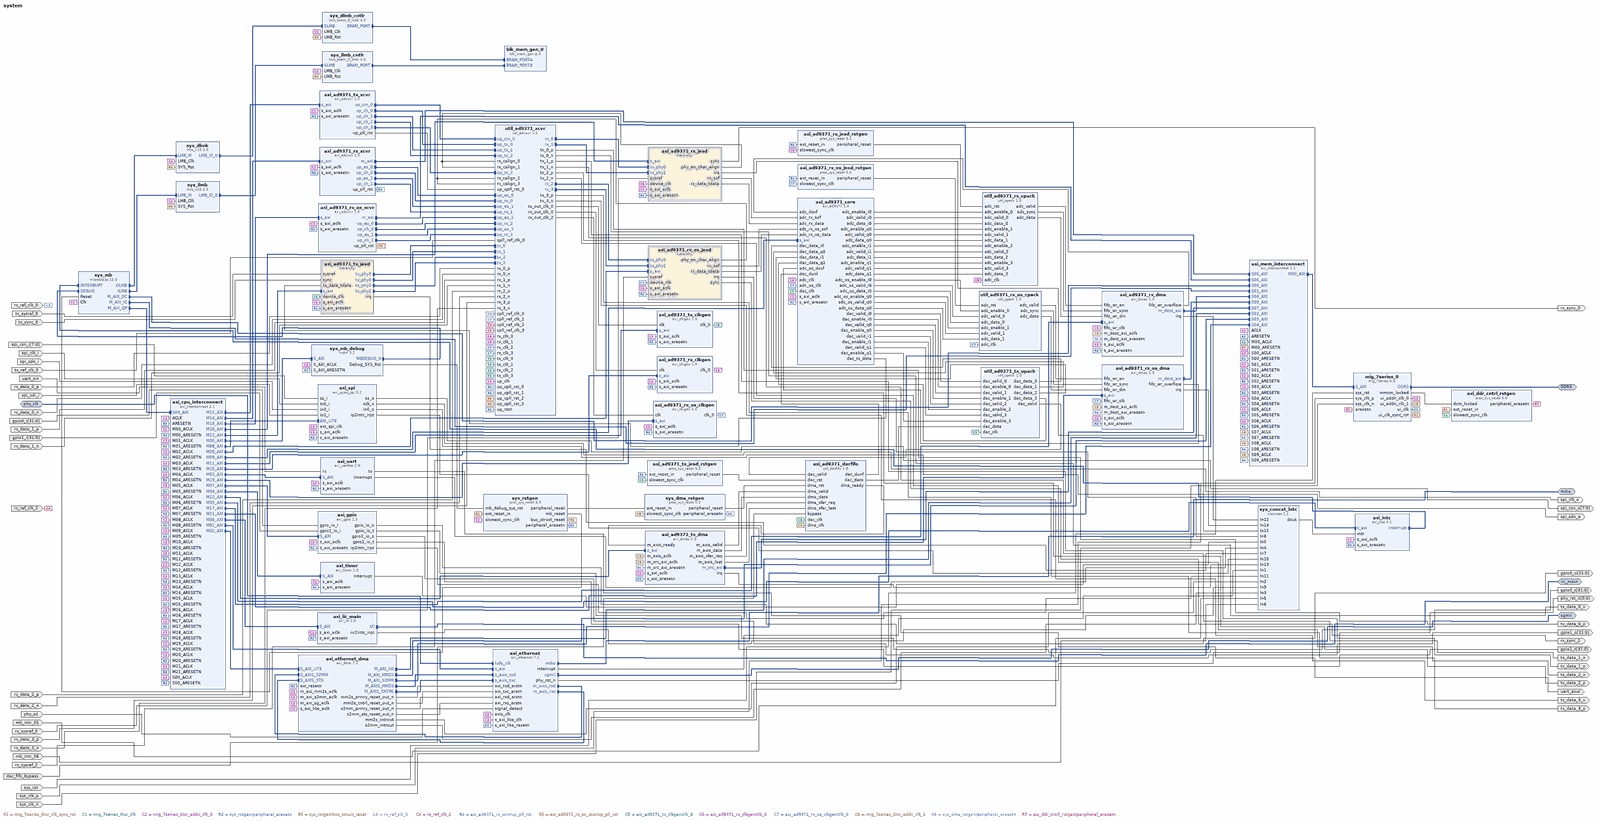
[diagram p0: block diagram of the top level, whole]
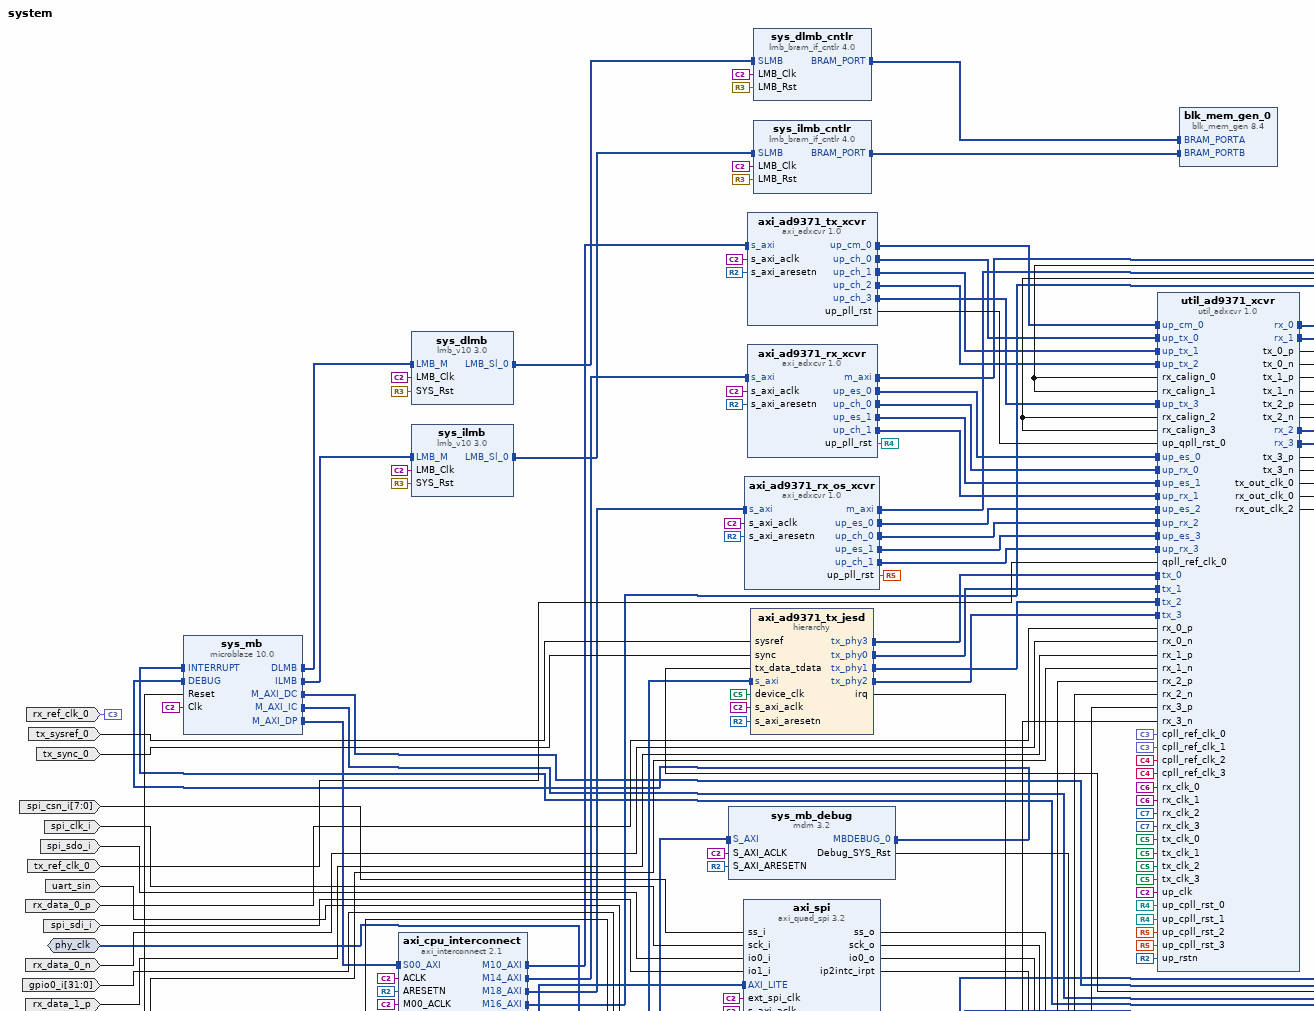
[diagram p1: block diagram of the top level, upper left part]
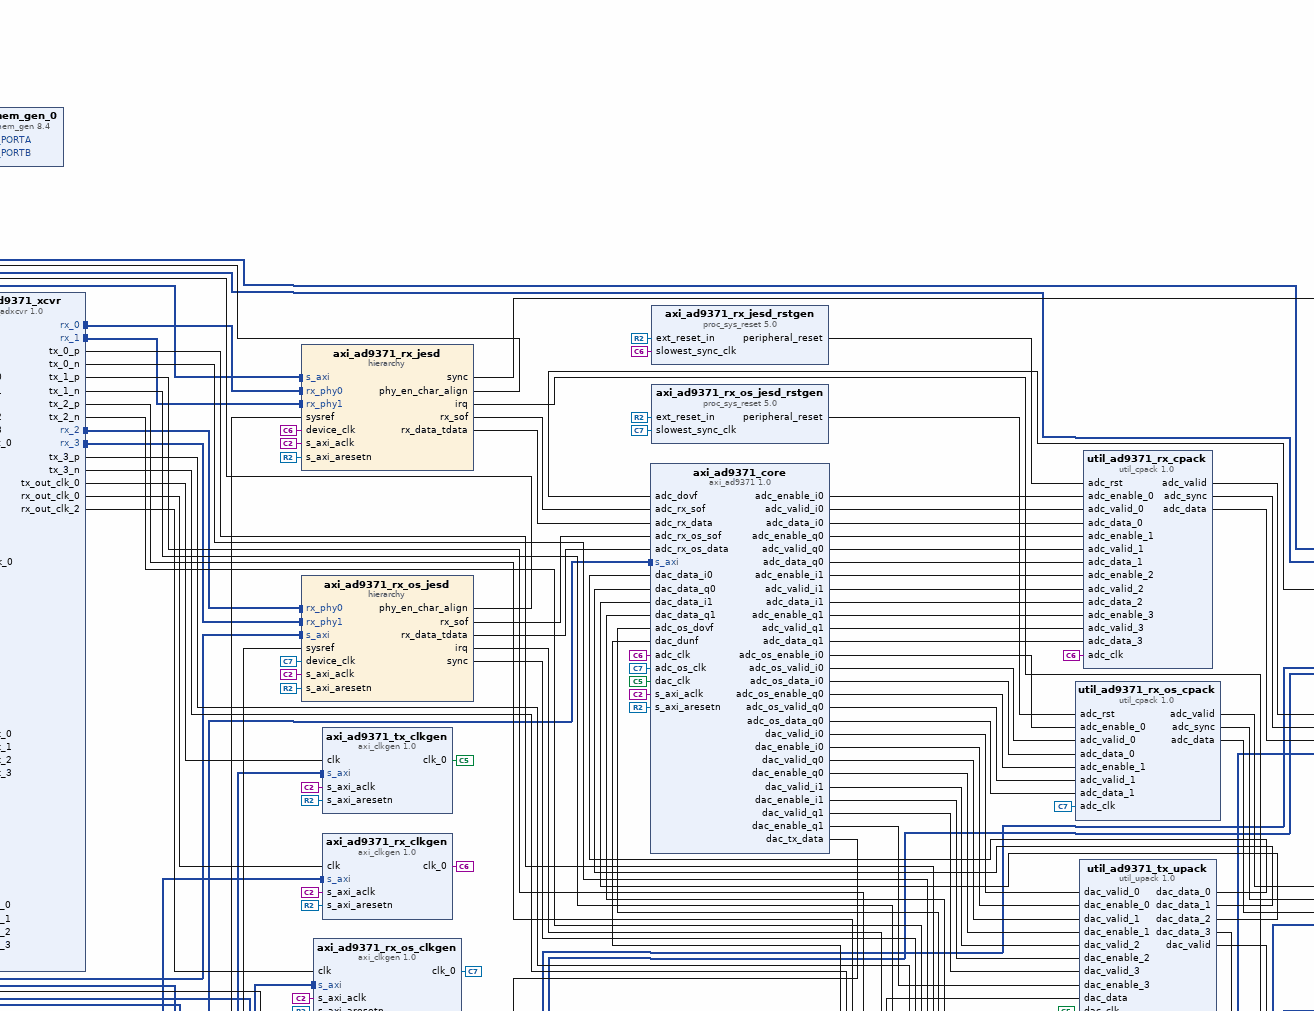
[diagram p2: block diagram of the top level, upper centre part]
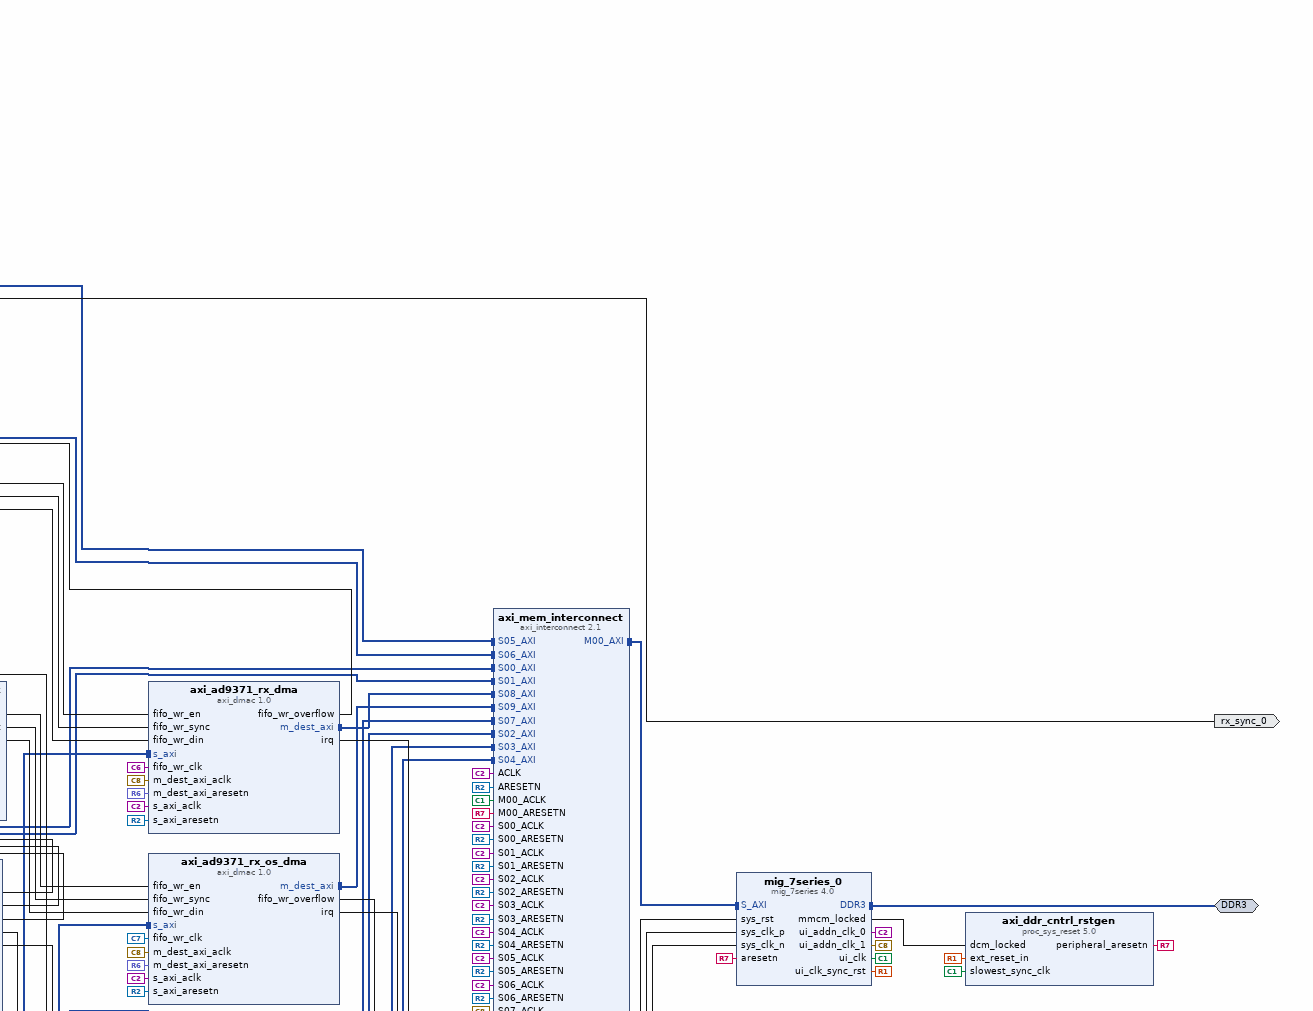
[diagram p3: block diagram of the top level, upper right part]
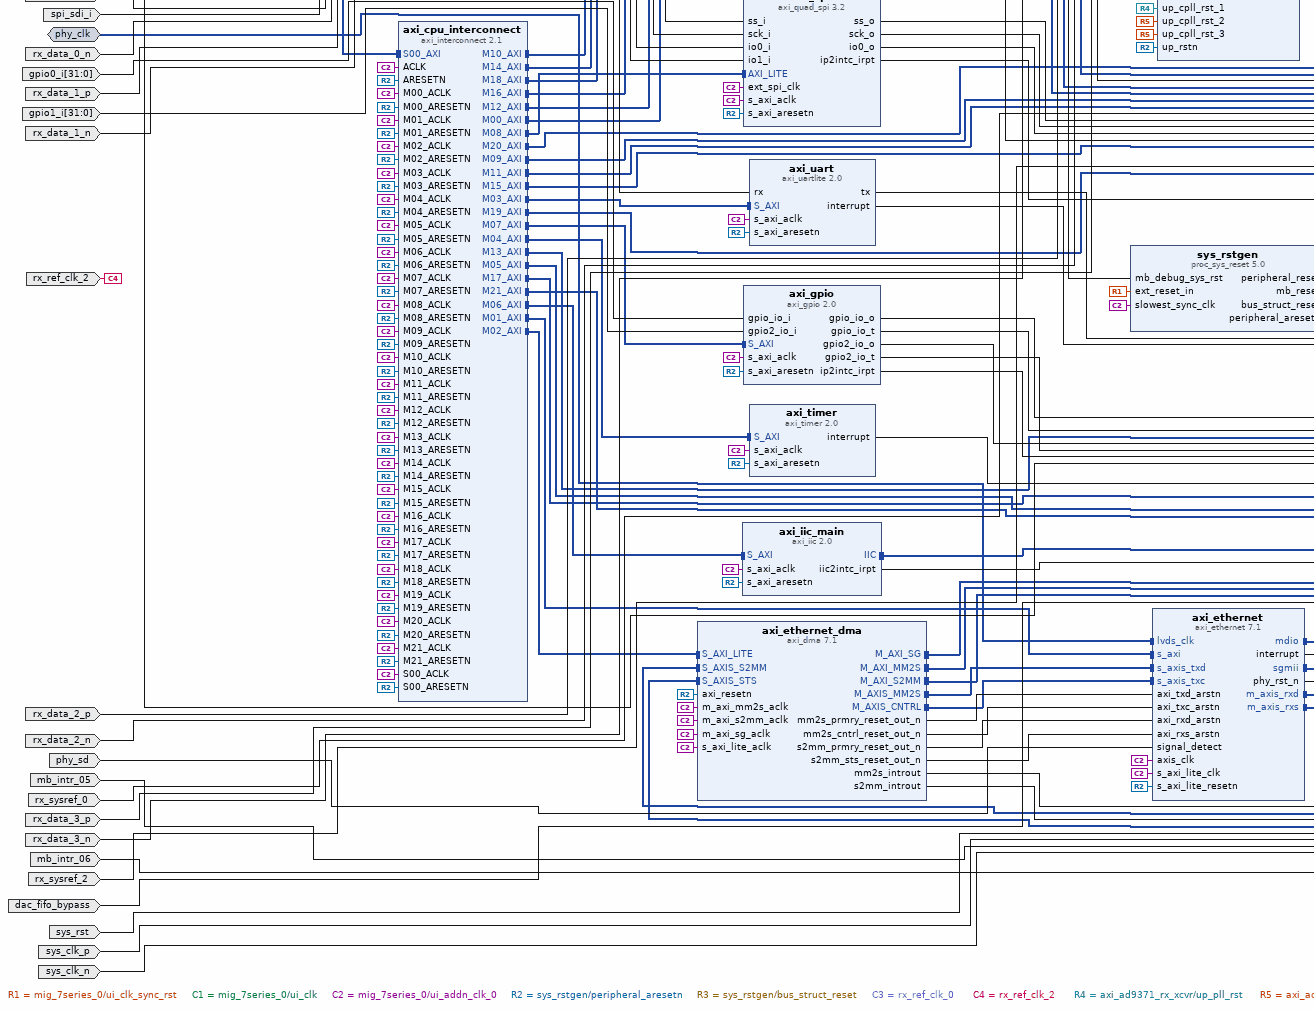
[diagram p4: block diagram of the top level, lower left part]
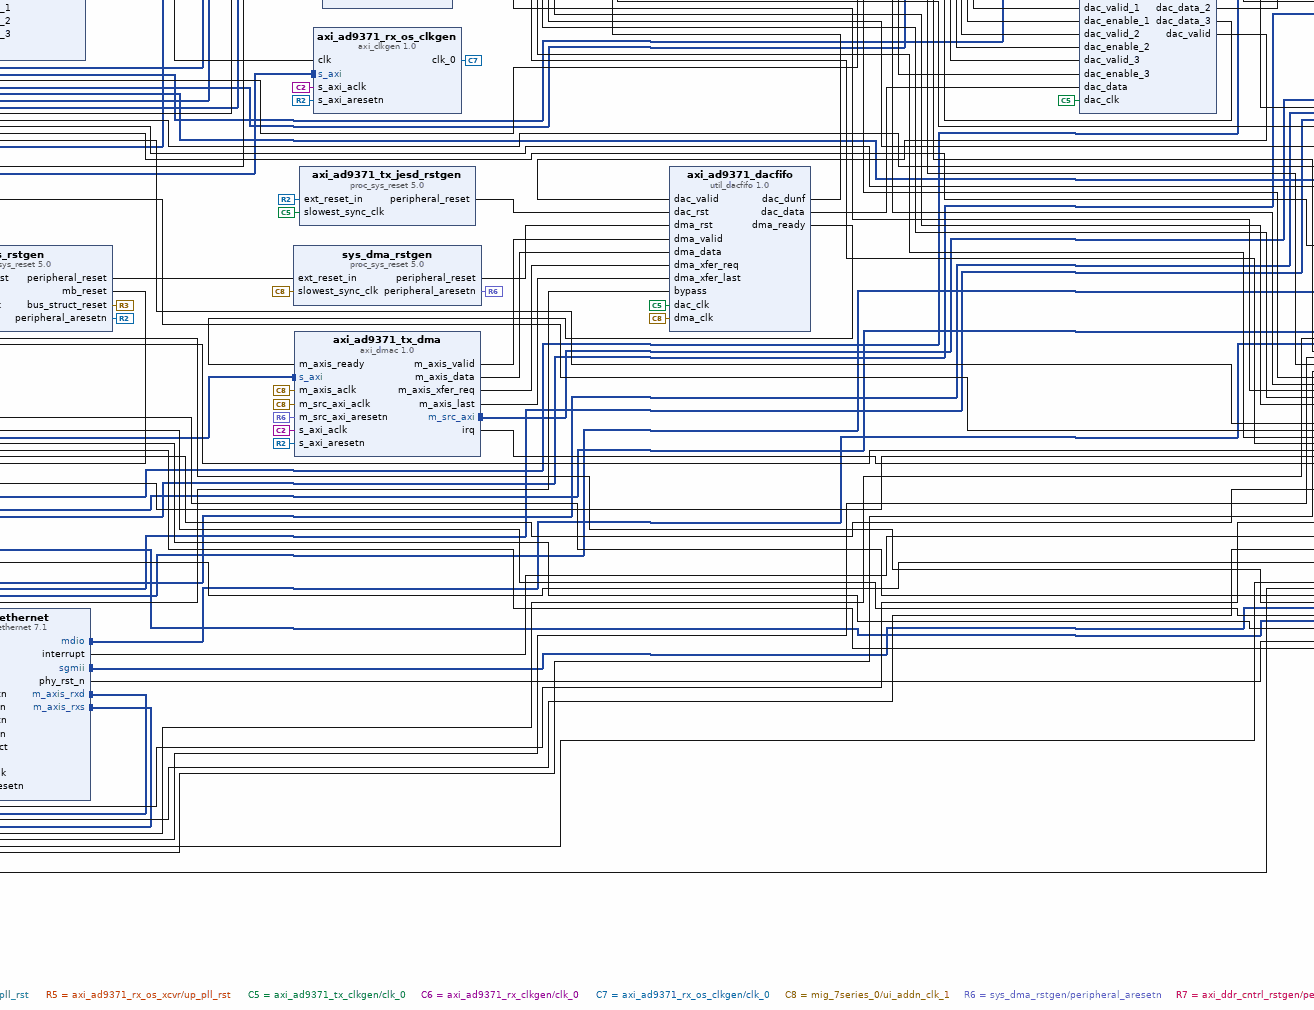
[diagram p5: block diagram of the top level, lower centre part]
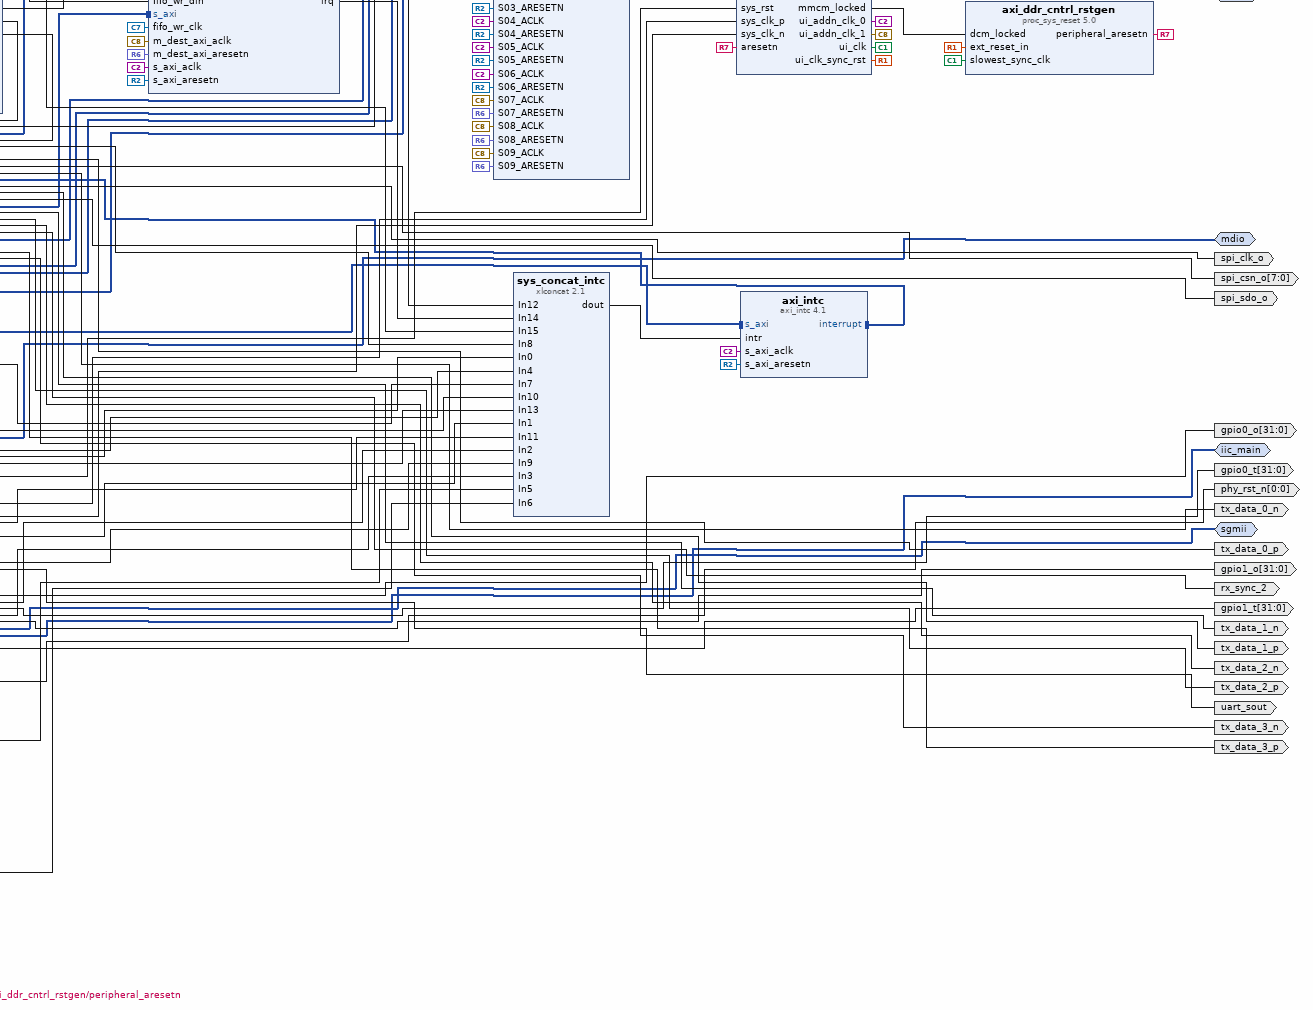
[diagram p6: block diagram of the top level, lower right part]
# Vivado block design system, xc7k325tffg900-2, Vivado 2017.4.1
create_bd_design system

create_bd_intf_port -mode Master -vlnv xilinx.com:interface:mdio_rtl:1.0 mdio
create_bd_intf_port -mode Master -vlnv xilinx.com:interface:sgmii_rtl:1.0 sgmii
create_bd_intf_port -mode Slave -vlnv xilinx.com:interface:diff_clock_rtl:1.0 phy_clk
set_property -dict {CONFIG.FREQ_HZ 625000000} [get_bd_intf_ports phy_clk]
create_bd_intf_port -mode Master -vlnv xilinx.com:interface:iic_rtl:1.0 iic_main
create_bd_intf_port -mode Master -vlnv xilinx.com:interface:ddrx_rtl:1.0 DDR3
create_bd_port -dir I phy_sd
create_bd_port -dir O -from 0 -to 0 -type rst phy_rst_n
create_bd_port -dir I uart_sin
create_bd_port -dir O uart_sout
create_bd_port -dir I -from 7 -to 0 spi_csn_i
create_bd_port -dir O -from 7 -to 0 spi_csn_o
create_bd_port -dir I spi_clk_i
create_bd_port -dir O spi_clk_o
create_bd_port -dir I spi_sdo_i
create_bd_port -dir O spi_sdo_o
create_bd_port -dir I spi_sdi_i
create_bd_port -dir I -from 31 -to 0 gpio0_i
create_bd_port -dir O -from 31 -to 0 gpio0_o
create_bd_port -dir O -from 31 -to 0 gpio0_t
create_bd_port -dir I -from 31 -to 0 gpio1_i
create_bd_port -dir O -from 31 -to 0 gpio1_o
create_bd_port -dir O -from 31 -to 0 gpio1_t
create_bd_port -dir I -type intr mb_intr_05
create_bd_port -dir I -type intr mb_intr_06
create_bd_port -dir I tx_ref_clk_0
create_bd_port -dir I rx_ref_clk_0
create_bd_port -dir I rx_ref_clk_2
create_bd_port -dir O tx_data_0_p
create_bd_port -dir O tx_data_0_n
create_bd_port -dir O tx_data_1_p
create_bd_port -dir O tx_data_1_n
create_bd_port -dir O tx_data_2_p
create_bd_port -dir O tx_data_2_n
create_bd_port -dir O tx_data_3_p
create_bd_port -dir O tx_data_3_n
create_bd_port -dir I tx_sysref_0
create_bd_port -dir I tx_sync_0
create_bd_port -dir I rx_data_0_p
create_bd_port -dir I rx_data_0_n
create_bd_port -dir I rx_data_1_p
create_bd_port -dir I rx_data_1_n
create_bd_port -dir I rx_sysref_0
create_bd_port -dir O rx_sync_0
create_bd_port -dir I rx_data_2_p
create_bd_port -dir I rx_data_2_n
create_bd_port -dir I rx_data_3_p
create_bd_port -dir I rx_data_3_n
create_bd_port -dir I rx_sysref_2
create_bd_port -dir O rx_sync_2
create_bd_port -dir I dac_fifo_bypass
create_bd_port -dir I -type rst sys_rst
set_property -dict {CONFIG.POLARITY ACTIVE_HIGH} [get_bd_ports sys_rst]
create_bd_port -dir I -type clk sys_clk_p
set_property -dict {CONFIG.FREQ_HZ 200000000} [get_bd_ports sys_clk_p]
create_bd_port -dir I -type clk sys_clk_n
set_property -dict {CONFIG.FREQ_HZ 200000000} [get_bd_ports sys_clk_n]

create_bd_cell -type hier axi_ad9371_tx_jesd
create_bd_cell -type hier axi_ad9371_rx_jesd
create_bd_cell -type hier axi_ad9371_rx_os_jesd
create_bd_cell -type ip -vlnv xilinx.com:ip:blk_mem_gen:8.4 blk_mem_gen_0
set_property -dict [list \
  CONFIG.Memory_Type True_Dual_Port_RAM \
  CONFIG.Enable_B Use_ENB_Pin \
  CONFIG.Use_RSTB_Pin true \
  CONFIG.Port_B_Clock 100 \
  CONFIG.Port_B_Write_Rate 50 \
  CONFIG.Port_B_Enable_Rate 100 \
  CONFIG.EN_SAFETY_CKT false \
] [get_bd_cells blk_mem_gen_0]
create_bd_cell -type ip -vlnv analog.com:user:axi_ad9371:1.0 axi_ad9371_core
create_bd_cell -type ip -vlnv analog.com:user:util_dacfifo:1.0 axi_ad9371_dacfifo
set_property -dict {CONFIG.ADDRESS_WIDTH 10 CONFIG.DATA_WIDTH 128} [get_bd_cells axi_ad9371_dacfifo]
create_bd_cell -type ip -vlnv analog.com:user:axi_clkgen:1.0 axi_ad9371_rx_clkgen
set_property -dict [list \
  CONFIG.ID 2 \
  CONFIG.DEVICE_TYPE 0 \
  CONFIG.CLKIN_PERIOD 8 \
  CONFIG.VCO_DIV 1 \
  CONFIG.VCO_MUL 8 \
  CONFIG.CLK0_DIV 8 \
] [get_bd_cells axi_ad9371_rx_clkgen]
create_bd_cell -type ip -vlnv analog.com:user:axi_dmac:1.0 axi_ad9371_rx_dma
set_property -dict [list \
  CONFIG.DMA_DATA_WIDTH_SRC 64 \
  CONFIG.DMA_2D_TRANSFER false \
  CONFIG.ASYNC_CLK_REQ_SRC true \
  CONFIG.ASYNC_CLK_SRC_DEST true \
  CONFIG.ASYNC_CLK_DEST_REQ true \
  CONFIG.AXI_SLICE_DEST false \
  CONFIG.AXI_SLICE_SRC false \
  CONFIG.SYNC_TRANSFER_START true \
  CONFIG.CYCLIC false \
  CONFIG.DMA_TYPE_DEST 0 \
  CONFIG.DMA_TYPE_SRC 2 \
] [get_bd_cells axi_ad9371_rx_dma]
create_bd_cell -type ip -vlnv xilinx.com:ip:proc_sys_reset:5.0 axi_ad9371_rx_jesd_rstgen
create_bd_cell -type ip -vlnv analog.com:user:axi_clkgen:1.0 axi_ad9371_rx_os_clkgen
set_property -dict [list \
  CONFIG.ID 2 \
  CONFIG.CLKIN_PERIOD 8 \
  CONFIG.VCO_DIV 1 \
  CONFIG.VCO_MUL 8 \
  CONFIG.CLK0_DIV 8 \
] [get_bd_cells axi_ad9371_rx_os_clkgen]
create_bd_cell -type ip -vlnv analog.com:user:axi_dmac:1.0 axi_ad9371_rx_os_dma
set_property -dict [list \
  CONFIG.DMA_DATA_WIDTH_SRC 64 \
  CONFIG.DMA_2D_TRANSFER false \
  CONFIG.ASYNC_CLK_REQ_SRC true \
  CONFIG.ASYNC_CLK_SRC_DEST true \
  CONFIG.ASYNC_CLK_DEST_REQ true \
  CONFIG.AXI_SLICE_DEST false \
  CONFIG.AXI_SLICE_SRC false \
  CONFIG.SYNC_TRANSFER_START true \
  CONFIG.CYCLIC false \
  CONFIG.DMA_TYPE_DEST 0 \
  CONFIG.DMA_TYPE_SRC 2 \
] [get_bd_cells axi_ad9371_rx_os_dma]
create_bd_cell -type ip -vlnv xilinx.com:ip:proc_sys_reset:5.0 axi_ad9371_rx_os_jesd_rstgen
create_bd_cell -type ip -vlnv analog.com:user:axi_adxcvr:1.0 axi_ad9371_rx_os_xcvr
set_property -dict [list \
  CONFIG.NUM_OF_LANES 2 \
  CONFIG.XCVR_TYPE 0 \
  CONFIG.TX_OR_RX_N 0 \
  CONFIG.QPLL_ENABLE 0 \
  CONFIG.LPM_OR_DFE_N 1 \
  CONFIG.SYS_CLK_SEL 00 \
  CONFIG.OUT_CLK_SEL {"011"} \
] [get_bd_cells axi_ad9371_rx_os_xcvr]
create_bd_cell -type ip -vlnv analog.com:user:axi_adxcvr:1.0 axi_ad9371_rx_xcvr
set_property -dict [list \
  CONFIG.NUM_OF_LANES 2 \
  CONFIG.XCVR_TYPE 0 \
  CONFIG.TX_OR_RX_N 0 \
  CONFIG.QPLL_ENABLE 0 \
  CONFIG.LPM_OR_DFE_N 1 \
  CONFIG.SYS_CLK_SEL 00 \
  CONFIG.OUT_CLK_SEL {"011"} \
] [get_bd_cells axi_ad9371_rx_xcvr]
create_bd_cell -type ip -vlnv analog.com:user:axi_clkgen:1.0 axi_ad9371_tx_clkgen
set_property -dict [list \
  CONFIG.ID 2 \
  CONFIG.DEVICE_TYPE 0 \
  CONFIG.CLKIN_PERIOD 8 \
  CONFIG.VCO_DIV 1 \
  CONFIG.VCO_MUL 8 \
  CONFIG.CLK0_DIV 8 \
] [get_bd_cells axi_ad9371_tx_clkgen]
create_bd_cell -type ip -vlnv analog.com:user:axi_dmac:1.0 axi_ad9371_tx_dma
set_property -dict [list \
  CONFIG.DMA_DATA_WIDTH_DEST 128 \
  CONFIG.DMA_2D_TRANSFER false \
  CONFIG.ASYNC_CLK_REQ_SRC true \
  CONFIG.ASYNC_CLK_SRC_DEST true \
  CONFIG.ASYNC_CLK_DEST_REQ true \
  CONFIG.AXI_SLICE_DEST true \
  CONFIG.AXI_SLICE_SRC false \
  CONFIG.CYCLIC true \
  CONFIG.DMA_TYPE_DEST 1 \
  CONFIG.DMA_TYPE_SRC 0 \
] [get_bd_cells axi_ad9371_tx_dma]
create_bd_cell -type ip -vlnv xilinx.com:ip:proc_sys_reset:5.0 axi_ad9371_tx_jesd_rstgen
create_bd_cell -type ip -vlnv analog.com:user:axi_adxcvr:1.0 axi_ad9371_tx_xcvr
set_property -dict [list \
  CONFIG.NUM_OF_LANES 4 \
  CONFIG.XCVR_TYPE 0 \
  CONFIG.TX_OR_RX_N 1 \
  CONFIG.QPLL_ENABLE 1 \
  CONFIG.LPM_OR_DFE_N 0 \
  CONFIG.SYS_CLK_SEL {"11"} \
  CONFIG.OUT_CLK_SEL {"011"} \
] [get_bd_cells axi_ad9371_tx_xcvr]
create_bd_cell -type ip -vlnv xilinx.com:ip:axi_interconnect:2.1 axi_cpu_interconnect
set_property -dict {CONFIG.NUM_MI 22} [get_bd_cells axi_cpu_interconnect]
create_bd_cell -type ip -vlnv xilinx.com:ip:proc_sys_reset:5.0 axi_ddr_cntrl_rstgen
create_bd_cell -type ip -vlnv xilinx.com:ip:axi_ethernet:7.1 axi_ethernet
set_property -dict [list \
  CONFIG.ETHERNET_BOARD_INTERFACE Custom \
  CONFIG.PHY_TYPE SGMII \
  CONFIG.PHYRST_BOARD_INTERFACE phy_reset_out \
  CONFIG.DIFFCLK_BOARD_INTERFACE Custom \
  CONFIG.MDIO_BOARD_INTERFACE mdio_mdc \
  CONFIG.ENABLE_LVDS true \
  CONFIG.RXMEM 8k \
  CONFIG.TXMEM 8k \
  CONFIG.TXCSUM Full \
  CONFIG.RXCSUM Full \
  CONFIG.lvdsclkrate 625 \
] [get_bd_cells axi_ethernet]
create_bd_cell -type ip -vlnv xilinx.com:ip:axi_dma:7.1 axi_ethernet_dma
set_property -dict [list \
  CONFIG.c_include_mm2s_dre 1 \
  CONFIG.c_sg_use_stsapp_length 1 \
  CONFIG.c_include_s2mm_dre 1 \
] [get_bd_cells axi_ethernet_dma]
create_bd_cell -type ip -vlnv xilinx.com:ip:axi_gpio:2.0 axi_gpio
set_property -dict [list \
  CONFIG.C_GPIO_WIDTH 32 \
  CONFIG.C_GPIO2_WIDTH 32 \
  CONFIG.C_IS_DUAL 1 \
  CONFIG.C_INTERRUPT_PRESENT 1 \
] [get_bd_cells axi_gpio]
create_bd_cell -type ip -vlnv xilinx.com:ip:axi_iic:2.0 axi_iic_main
create_bd_cell -type ip -vlnv xilinx.com:ip:axi_intc:4.1 axi_intc
set_property -dict {CONFIG.C_HAS_FAST 0} [get_bd_cells axi_intc]
create_bd_cell -type ip -vlnv xilinx.com:ip:axi_interconnect:2.1 axi_mem_interconnect
set_property -dict [list \
  CONFIG.NUM_SI 10 \
  CONFIG.NUM_MI 1 \
  CONFIG.STRATEGY 2 \
  CONFIG.S00_HAS_DATA_FIFO 2 \
  CONFIG.S01_HAS_DATA_FIFO 2 \
  CONFIG.S02_HAS_DATA_FIFO 2 \
  CONFIG.S03_HAS_DATA_FIFO 2 \
  CONFIG.S04_HAS_DATA_FIFO 2 \
  CONFIG.S05_HAS_DATA_FIFO 2 \
  CONFIG.S06_HAS_DATA_FIFO 2 \
  CONFIG.S07_HAS_DATA_FIFO 2 \
  CONFIG.S08_HAS_DATA_FIFO 2 \
  CONFIG.S09_HAS_DATA_FIFO 2 \
] [get_bd_cells axi_mem_interconnect]
create_bd_cell -type ip -vlnv xilinx.com:ip:axi_quad_spi:3.2 axi_spi
set_property -dict [list \
  CONFIG.C_USE_STARTUP 0 \
  CONFIG.C_NUM_SS_BITS 8 \
  CONFIG.C_SCK_RATIO 8 \
  CONFIG.C_FAMILY kintexu \
  CONFIG.UC_FAMILY 1 \
  CONFIG.C_SUB_FAMILY kintexu \
  CONFIG.C_S_AXI4_ID_WIDTH 0 \
] [get_bd_cells axi_spi]
create_bd_cell -type ip -vlnv xilinx.com:ip:axi_timer:2.0 axi_timer
create_bd_cell -type ip -vlnv xilinx.com:ip:axi_uartlite:2.0 axi_uart
set_property -dict {CONFIG.C_BAUDRATE 115200} [get_bd_cells axi_uart]
create_bd_cell -type ip -vlnv xilinx.com:ip:xlconcat:2.1 sys_concat_intc
set_property -dict {CONFIG.NUM_PORTS 16 CONFIG.dout_width 16} [get_bd_cells sys_concat_intc]
create_bd_cell -type ip -vlnv xilinx.com:ip:lmb_v10:3.0 sys_dlmb
create_bd_cell -type ip -vlnv xilinx.com:ip:lmb_bram_if_cntlr:4.0 sys_dlmb_cntlr
set_property -dict {CONFIG.C_ECC 0} [get_bd_cells sys_dlmb_cntlr]
create_bd_cell -type ip -vlnv xilinx.com:ip:proc_sys_reset:5.0 sys_dma_rstgen
set_property -dict {CONFIG.C_EXT_RST_WIDTH 1} [get_bd_cells sys_dma_rstgen]
create_bd_cell -type ip -vlnv xilinx.com:ip:lmb_v10:3.0 sys_ilmb
create_bd_cell -type ip -vlnv xilinx.com:ip:lmb_bram_if_cntlr:4.0 sys_ilmb_cntlr
set_property -dict {CONFIG.C_ECC 0} [get_bd_cells sys_ilmb_cntlr]
create_bd_cell -type ip -vlnv xilinx.com:ip:microblaze:10.0 sys_mb
set_property -dict [list \
  CONFIG.C_D_AXI 1 \
  CONFIG.G_TEMPLATE_LIST 4 \
  CONFIG.G_USE_EXCEPTIONS 1 \
  CONFIG.C_USE_MSR_INSTR 1 \
  CONFIG.C_USE_PCMP_INSTR 1 \
  CONFIG.C_USE_BARREL 1 \
  CONFIG.C_USE_DIV 1 \
  CONFIG.C_USE_HW_MUL 2 \
  CONFIG.C_UNALIGNED_EXCEPTIONS 1 \
  CONFIG.C_ILL_OPCODE_EXCEPTION 1 \
  CONFIG.C_M_AXI_I_BUS_EXCEPTION 1 \
  CONFIG.C_M_AXI_D_BUS_EXCEPTION 1 \
  CONFIG.C_DIV_ZERO_EXCEPTION 1 \
  CONFIG.C_PVR 2 \
  CONFIG.C_OPCODE_0x0_ILLEGAL 1 \
  CONFIG.C_USE_ICACHE 1 \
  CONFIG.C_CACHE_BYTE_SIZE 16384 \
  CONFIG.C_ICACHE_LINE_LEN 8 \
  CONFIG.C_ICACHE_VICTIMS 8 \
  CONFIG.C_ICACHE_STREAMS 1 \
  CONFIG.C_USE_DCACHE 1 \
  CONFIG.C_DCACHE_BYTE_SIZE 16384 \
  CONFIG.C_USE_MMU 3 \
  CONFIG.C_MMU_ZONES 2 \
] [get_bd_cells sys_mb]
create_bd_cell -type ip -vlnv xilinx.com:ip:mdm:3.2 sys_mb_debug
set_property -dict {CONFIG.C_USE_UART 1} [get_bd_cells sys_mb_debug]
create_bd_cell -type ip -vlnv xilinx.com:ip:proc_sys_reset:5.0 sys_rstgen
create_bd_cell -type ip -vlnv analog.com:user:util_cpack:1.0 util_ad9371_rx_cpack
set_property -dict {CONFIG.CHANNEL_DATA_WIDTH 16 CONFIG.NUM_OF_CHANNELS 4} [get_bd_cells util_ad9371_rx_cpack]
create_bd_cell -type ip -vlnv analog.com:user:util_cpack:1.0 util_ad9371_rx_os_cpack
set_property -dict {CONFIG.CHANNEL_DATA_WIDTH 32 CONFIG.NUM_OF_CHANNELS 2} [get_bd_cells util_ad9371_rx_os_cpack]
create_bd_cell -type ip -vlnv analog.com:user:util_upack:1.0 util_ad9371_tx_upack
set_property -dict {CONFIG.CHANNEL_DATA_WIDTH 32 CONFIG.NUM_OF_CHANNELS 4} [get_bd_cells util_ad9371_tx_upack]
create_bd_cell -type ip -vlnv analog.com:user:util_adxcvr:1.0 util_ad9371_xcvr
set_property -dict [list \
  CONFIG.XCVR_TYPE 0 \
  CONFIG.QPLL_REFCLK_DIV 1 \
  CONFIG.QPLL_FBDIV {"0001010000"} \
  CONFIG.CPLL_FBDIV 4 \
  CONFIG.TX_NUM_OF_LANES 4 \
  CONFIG.TX_OUT_DIV 2 \
  CONFIG.TX_CLK25_DIV 5 \
  CONFIG.RX_NUM_OF_LANES 4 \
  CONFIG.RX_CLK25_DIV 5 \
  CONFIG.RX_PMA_CFG 0x00018480 \
  CONFIG.RX_CDR_CFG 0x03000023ff10400020 \
] [get_bd_cells util_ad9371_xcvr]
create_bd_cell -type ip -vlnv xilinx.com:ip:mig_7series:4.0 mig_7series_0
set_property -dict [list \
  CONFIG.XML_INPUT_FILE mig_b.prj \
  CONFIG.RESET_BOARD_INTERFACE Custom \
  CONFIG.MIG_DONT_TOUCH_PARAM Custom \
  CONFIG.BOARD_MIG_PARAM ddr3_sdram \
] [get_bd_cells mig_7series_0]

# ---- hierarchy /axi_ad9371_tx_jesd ----
current_bd_instance /axi_ad9371_tx_jesd
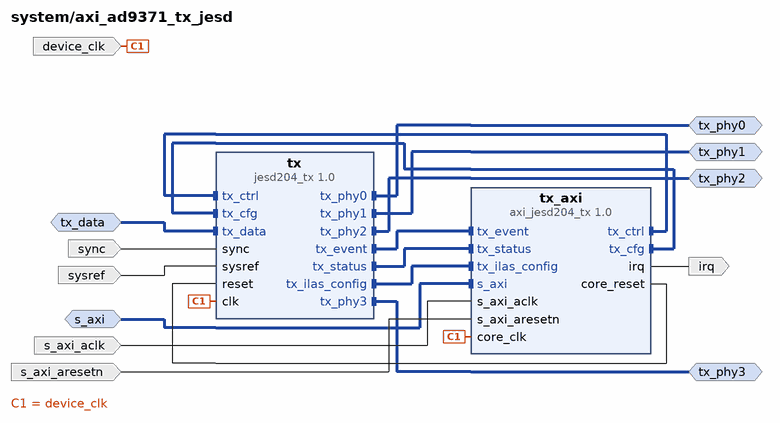
[diagram p7: block diagram inside /axi_ad9371_tx_jesd]
create_bd_intf_pin -mode Slave -vlnv xilinx.com:interface:aximm_rtl:1.0 s_axi
create_bd_intf_pin -mode Slave -vlnv xilinx.com:interface:axis_rtl:1.0 tx_data
create_bd_intf_pin -mode Master -vlnv xilinx.com:display_jesd204:jesd204_tx_bus_rtl:1.0 tx_phy0
create_bd_intf_pin -mode Master -vlnv xilinx.com:display_jesd204:jesd204_tx_bus_rtl:1.0 tx_phy1
create_bd_intf_pin -mode Master -vlnv xilinx.com:display_jesd204:jesd204_tx_bus_rtl:1.0 tx_phy2
create_bd_intf_pin -mode Master -vlnv xilinx.com:display_jesd204:jesd204_tx_bus_rtl:1.0 tx_phy3
create_bd_pin -dir I -type clk s_axi_aclk
create_bd_pin -dir I -type rst s_axi_aresetn
create_bd_pin -dir O -type intr irq
create_bd_pin -dir I -type clk device_clk
create_bd_pin -dir I sync
create_bd_pin -dir I sysref

create_bd_cell -type ip -vlnv analog.com:user:jesd204_tx:1.0 tx
set_property -dict {CONFIG.NUM_LANES 4} [get_bd_cells tx]
create_bd_cell -type ip -vlnv analog.com:user:axi_jesd204_tx:1.0 tx_axi
set_property -dict {CONFIG.NUM_LANES 4} [get_bd_cells tx_axi]

# ---- hierarchy /axi_ad9371_rx_jesd ----
current_bd_instance /axi_ad9371_rx_jesd
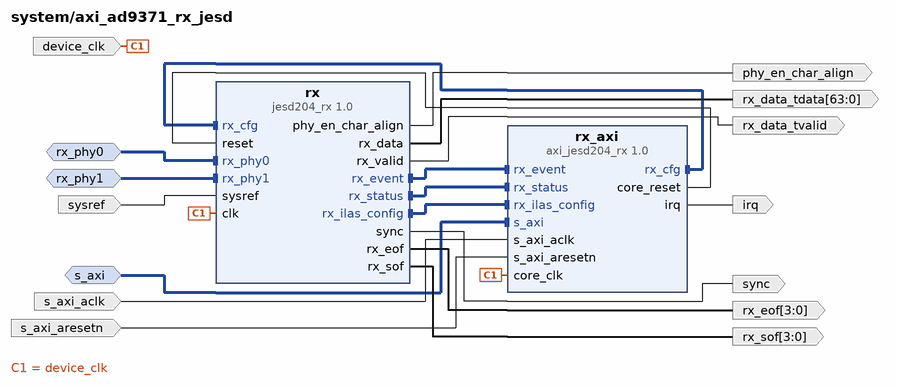
[diagram p8: block diagram inside /axi_ad9371_rx_jesd]
create_bd_intf_pin -mode Slave -vlnv xilinx.com:interface:aximm_rtl:1.0 s_axi
create_bd_intf_pin -mode Slave -vlnv xilinx.com:display_jesd204:jesd204_rx_bus_rtl:1.0 rx_phy0
create_bd_intf_pin -mode Slave -vlnv xilinx.com:display_jesd204:jesd204_rx_bus_rtl:1.0 rx_phy1
create_bd_pin -dir I -type clk s_axi_aclk
create_bd_pin -dir I -type rst s_axi_aresetn
create_bd_pin -dir O -type intr irq
create_bd_pin -dir I -type clk device_clk
create_bd_pin -dir O sync
create_bd_pin -dir I sysref
create_bd_pin -dir O phy_en_char_align
create_bd_pin -dir O -from 3 -to 0 rx_eof
create_bd_pin -dir O -from 3 -to 0 rx_sof
create_bd_pin -dir O rx_data_tvalid
create_bd_pin -dir O -from 63 -to 0 rx_data_tdata

create_bd_cell -type ip -vlnv analog.com:user:jesd204_rx:1.0 rx
set_property -dict {CONFIG.NUM_LANES 2} [get_bd_cells rx]
create_bd_cell -type ip -vlnv analog.com:user:axi_jesd204_rx:1.0 rx_axi
set_property -dict {CONFIG.NUM_LANES 2} [get_bd_cells rx_axi]

# ---- hierarchy /axi_ad9371_rx_os_jesd ----
current_bd_instance /axi_ad9371_rx_os_jesd
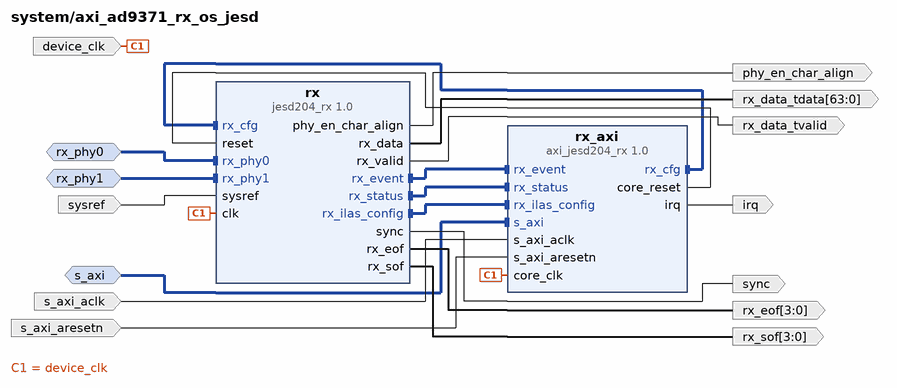
[diagram p9: block diagram inside /axi_ad9371_rx_os_jesd]
create_bd_intf_pin -mode Slave -vlnv xilinx.com:interface:aximm_rtl:1.0 s_axi
create_bd_intf_pin -mode Slave -vlnv xilinx.com:display_jesd204:jesd204_rx_bus_rtl:1.0 rx_phy0
create_bd_intf_pin -mode Slave -vlnv xilinx.com:display_jesd204:jesd204_rx_bus_rtl:1.0 rx_phy1
create_bd_pin -dir I -type clk s_axi_aclk
create_bd_pin -dir I -type rst s_axi_aresetn
create_bd_pin -dir O -type intr irq
create_bd_pin -dir I -type clk device_clk
create_bd_pin -dir O sync
create_bd_pin -dir I sysref
create_bd_pin -dir O phy_en_char_align
create_bd_pin -dir O -from 3 -to 0 rx_eof
create_bd_pin -dir O -from 3 -to 0 rx_sof
create_bd_pin -dir O rx_data_tvalid
create_bd_pin -dir O -from 63 -to 0 rx_data_tdata

create_bd_cell -type ip -vlnv analog.com:user:jesd204_rx:1.0 rx
set_property -dict {CONFIG.NUM_LANES 2} [get_bd_cells rx]
create_bd_cell -type ip -vlnv analog.com:user:axi_jesd204_rx:1.0 rx_axi
set_property -dict {CONFIG.NUM_LANES 2} [get_bd_cells rx_axi]

# ---- connections ----

current_bd_instance /axi_ad9371_tx_jesd
connect_bd_intf_net [get_bd_intf_pins tx_axi/tx_ctrl] [get_bd_intf_pins tx/tx_ctrl]
connect_bd_intf_net [get_bd_intf_pins tx_axi/tx_cfg] [get_bd_intf_pins tx/tx_cfg]
connect_bd_intf_net [get_bd_intf_pins tx/tx_event] [get_bd_intf_pins tx_axi/tx_event]
connect_bd_intf_net [get_bd_intf_pins tx/tx_status] [get_bd_intf_pins tx_axi/tx_status]
connect_bd_intf_net [get_bd_intf_pins tx/tx_ilas_config] [get_bd_intf_pins tx_axi/tx_ilas_config]
connect_bd_intf_net [get_bd_intf_pins s_axi] [get_bd_intf_pins tx_axi/s_axi]
connect_bd_intf_net [get_bd_intf_pins tx_data] [get_bd_intf_pins tx/tx_data]
connect_bd_intf_net [get_bd_intf_pins tx_phy0] [get_bd_intf_pins tx/tx_phy0]
connect_bd_intf_net [get_bd_intf_pins tx_phy1] [get_bd_intf_pins tx/tx_phy1]
connect_bd_intf_net [get_bd_intf_pins tx_phy2] [get_bd_intf_pins tx/tx_phy2]
connect_bd_intf_net [get_bd_intf_pins tx_phy3] [get_bd_intf_pins tx/tx_phy3]
connect_bd_net [get_bd_pins tx_axi/core_reset] [get_bd_pins tx/reset]
connect_bd_net [get_bd_pins s_axi_aclk] [get_bd_pins tx_axi/s_axi_aclk]
connect_bd_net [get_bd_pins s_axi_aresetn] [get_bd_pins tx_axi/s_axi_aresetn]
connect_bd_net [get_bd_pins tx_axi/irq] [get_bd_pins irq]
connect_bd_net [get_bd_pins device_clk] [get_bd_pins tx/clk] [get_bd_pins tx_axi/core_clk]
connect_bd_net [get_bd_pins sync] [get_bd_pins tx/sync]
connect_bd_net [get_bd_pins sysref] [get_bd_pins tx/sysref]

current_bd_instance /axi_ad9371_rx_jesd
connect_bd_intf_net [get_bd_intf_pins rx_axi/rx_cfg] [get_bd_intf_pins rx/rx_cfg]
connect_bd_intf_net [get_bd_intf_pins rx/rx_event] [get_bd_intf_pins rx_axi/rx_event]
connect_bd_intf_net [get_bd_intf_pins rx/rx_status] [get_bd_intf_pins rx_axi/rx_status]
connect_bd_intf_net [get_bd_intf_pins rx/rx_ilas_config] [get_bd_intf_pins rx_axi/rx_ilas_config]
connect_bd_intf_net [get_bd_intf_pins s_axi] [get_bd_intf_pins rx_axi/s_axi]
connect_bd_intf_net [get_bd_intf_pins rx_phy0] [get_bd_intf_pins rx/rx_phy0]
connect_bd_intf_net [get_bd_intf_pins rx_phy1] [get_bd_intf_pins rx/rx_phy1]
connect_bd_net [get_bd_pins rx_axi/core_reset] [get_bd_pins rx/reset]
connect_bd_net [get_bd_pins s_axi_aclk] [get_bd_pins rx_axi/s_axi_aclk]
connect_bd_net [get_bd_pins s_axi_aresetn] [get_bd_pins rx_axi/s_axi_aresetn]
connect_bd_net [get_bd_pins rx_axi/irq] [get_bd_pins irq]
connect_bd_net [get_bd_pins device_clk] [get_bd_pins rx/clk] [get_bd_pins rx_axi/core_clk]
connect_bd_net [get_bd_pins rx/sync] [get_bd_pins sync]
connect_bd_net [get_bd_pins sysref] [get_bd_pins rx/sysref]
connect_bd_net [get_bd_pins rx/phy_en_char_align] [get_bd_pins phy_en_char_align]
connect_bd_net [get_bd_pins rx/rx_data] [get_bd_pins rx_data_tdata]
connect_bd_net [get_bd_pins rx/rx_valid] [get_bd_pins rx_data_tvalid]
connect_bd_net [get_bd_pins rx/rx_eof] [get_bd_pins rx_eof]
connect_bd_net [get_bd_pins rx/rx_sof] [get_bd_pins rx_sof]

current_bd_instance /axi_ad9371_rx_os_jesd
connect_bd_intf_net [get_bd_intf_pins rx_axi/rx_cfg] [get_bd_intf_pins rx/rx_cfg]
connect_bd_intf_net [get_bd_intf_pins rx/rx_event] [get_bd_intf_pins rx_axi/rx_event]
connect_bd_intf_net [get_bd_intf_pins rx/rx_status] [get_bd_intf_pins rx_axi/rx_status]
connect_bd_intf_net [get_bd_intf_pins rx/rx_ilas_config] [get_bd_intf_pins rx_axi/rx_ilas_config]
connect_bd_intf_net [get_bd_intf_pins s_axi] [get_bd_intf_pins rx_axi/s_axi]
connect_bd_intf_net [get_bd_intf_pins rx_phy0] [get_bd_intf_pins rx/rx_phy0]
connect_bd_intf_net [get_bd_intf_pins rx_phy1] [get_bd_intf_pins rx/rx_phy1]
connect_bd_net [get_bd_pins rx_axi/core_reset] [get_bd_pins rx/reset]
connect_bd_net [get_bd_pins s_axi_aclk] [get_bd_pins rx_axi/s_axi_aclk]
connect_bd_net [get_bd_pins s_axi_aresetn] [get_bd_pins rx_axi/s_axi_aresetn]
connect_bd_net [get_bd_pins rx_axi/irq] [get_bd_pins irq]
connect_bd_net [get_bd_pins device_clk] [get_bd_pins rx/clk] [get_bd_pins rx_axi/core_clk]
connect_bd_net [get_bd_pins rx/sync] [get_bd_pins sync]
connect_bd_net [get_bd_pins sysref] [get_bd_pins rx/sysref]
connect_bd_net [get_bd_pins rx/phy_en_char_align] [get_bd_pins phy_en_char_align]
connect_bd_net [get_bd_pins rx/rx_data] [get_bd_pins rx_data_tdata]
connect_bd_net [get_bd_pins rx/rx_valid] [get_bd_pins rx_data_tvalid]
connect_bd_net [get_bd_pins rx/rx_eof] [get_bd_pins rx_eof]
connect_bd_net [get_bd_pins rx/rx_sof] [get_bd_pins rx_sof]

current_bd_instance /
connect_bd_intf_net [get_bd_intf_pins sys_mb/DLMB] [get_bd_intf_pins sys_dlmb/LMB_M]
connect_bd_intf_net [get_bd_intf_pins sys_mb/ILMB] [get_bd_intf_pins sys_ilmb/LMB_M]
connect_bd_intf_net [get_bd_intf_pins sys_dlmb/LMB_Sl_0] [get_bd_intf_pins sys_dlmb_cntlr/SLMB]
connect_bd_intf_net [get_bd_intf_pins sys_ilmb/LMB_Sl_0] [get_bd_intf_pins sys_ilmb_cntlr/SLMB]
connect_bd_intf_net [get_bd_intf_pins sys_mb_debug/MBDEBUG_0] [get_bd_intf_pins sys_mb/DEBUG]
connect_bd_intf_net [get_bd_intf_pins axi_intc/interrupt] [get_bd_intf_pins sys_mb/INTERRUPT]
connect_bd_intf_net [get_bd_intf_pins axi_ethernet/s_axis_txd] [get_bd_intf_pins axi_ethernet_dma/M_AXIS_MM2S]
connect_bd_intf_net [get_bd_intf_pins axi_ethernet/s_axis_txc] [get_bd_intf_pins axi_ethernet_dma/M_AXIS_CNTRL]
connect_bd_intf_net [get_bd_intf_pins axi_ethernet/m_axis_rxd] [get_bd_intf_pins axi_ethernet_dma/S_AXIS_S2MM]
connect_bd_intf_net [get_bd_intf_pins axi_ethernet/m_axis_rxs] [get_bd_intf_pins axi_ethernet_dma/S_AXIS_STS]
connect_bd_intf_net [get_bd_intf_pins axi_cpu_interconnect/S00_AXI] [get_bd_intf_pins sys_mb/M_AXI_DP]
connect_bd_intf_net [get_bd_intf_pins axi_cpu_interconnect/M00_AXI] [get_bd_intf_pins sys_mb_debug/S_AXI]
connect_bd_intf_net [get_bd_intf_pins axi_cpu_interconnect/M01_AXI] [get_bd_intf_pins axi_ethernet/s_axi]
connect_bd_intf_net [get_bd_intf_pins axi_cpu_interconnect/M02_AXI] [get_bd_intf_pins axi_ethernet_dma/S_AXI_LITE]
connect_bd_intf_net [get_bd_intf_pins axi_cpu_interconnect/M03_AXI] [get_bd_intf_pins axi_uart/S_AXI]
connect_bd_intf_net [get_bd_intf_pins axi_cpu_interconnect/M04_AXI] [get_bd_intf_pins axi_timer/S_AXI]
connect_bd_intf_net [get_bd_intf_pins axi_cpu_interconnect/M05_AXI] [get_bd_intf_pins axi_intc/s_axi]
connect_bd_intf_net [get_bd_intf_pins axi_cpu_interconnect/M06_AXI] [get_bd_intf_pins axi_iic_main/S_AXI]
connect_bd_intf_net [get_bd_intf_pins axi_cpu_interconnect/M07_AXI] [get_bd_intf_pins axi_gpio/S_AXI]
connect_bd_intf_net [get_bd_intf_pins axi_cpu_interconnect/M08_AXI] [get_bd_intf_pins axi_spi/AXI_LITE]
connect_bd_intf_net [get_bd_intf_pins axi_mem_interconnect/S00_AXI] [get_bd_intf_pins sys_mb/M_AXI_DC]
connect_bd_intf_net [get_bd_intf_pins axi_mem_interconnect/S01_AXI] [get_bd_intf_pins sys_mb/M_AXI_IC]
connect_bd_intf_net [get_bd_intf_pins axi_mem_interconnect/S02_AXI] [get_bd_intf_pins axi_ethernet_dma/M_AXI_SG]
connect_bd_intf_net [get_bd_intf_pins axi_mem_interconnect/S03_AXI] [get_bd_intf_pins axi_ethernet_dma/M_AXI_MM2S]
connect_bd_intf_net [get_bd_intf_pins axi_mem_interconnect/S04_AXI] [get_bd_intf_pins axi_ethernet_dma/M_AXI_S2MM]
connect_bd_intf_net [get_bd_intf_pins axi_ad9371_tx_xcvr/up_cm_0] [get_bd_intf_pins util_ad9371_xcvr/up_cm_0]
connect_bd_intf_net [get_bd_intf_pins axi_ad9371_tx_xcvr/up_ch_0] [get_bd_intf_pins util_ad9371_xcvr/up_tx_0]
connect_bd_intf_net [get_bd_intf_pins axi_ad9371_tx_xcvr/up_ch_1] [get_bd_intf_pins util_ad9371_xcvr/up_tx_1]
connect_bd_intf_net [get_bd_intf_pins axi_ad9371_tx_xcvr/up_ch_2] [get_bd_intf_pins util_ad9371_xcvr/up_tx_2]
connect_bd_intf_net [get_bd_intf_pins axi_ad9371_tx_xcvr/up_ch_3] [get_bd_intf_pins util_ad9371_xcvr/up_tx_3]
connect_bd_intf_net [get_bd_intf_pins util_ad9371_xcvr/tx_0] [get_bd_intf_pins axi_ad9371_tx_jesd/tx_phy3]
connect_bd_intf_net [get_bd_intf_pins util_ad9371_xcvr/tx_1] [get_bd_intf_pins axi_ad9371_tx_jesd/tx_phy0]
connect_bd_intf_net [get_bd_intf_pins util_ad9371_xcvr/tx_2] [get_bd_intf_pins axi_ad9371_tx_jesd/tx_phy1]
connect_bd_intf_net [get_bd_intf_pins util_ad9371_xcvr/tx_3] [get_bd_intf_pins axi_ad9371_tx_jesd/tx_phy2]
connect_bd_intf_net [get_bd_intf_pins axi_ad9371_rx_xcvr/up_es_0] [get_bd_intf_pins util_ad9371_xcvr/up_es_0]
connect_bd_intf_net [get_bd_intf_pins axi_ad9371_rx_xcvr/up_ch_0] [get_bd_intf_pins util_ad9371_xcvr/up_rx_0]
connect_bd_intf_net [get_bd_intf_pins util_ad9371_xcvr/rx_0] [get_bd_intf_pins axi_ad9371_rx_jesd/rx_phy0]
connect_bd_intf_net [get_bd_intf_pins axi_ad9371_rx_xcvr/up_es_1] [get_bd_intf_pins util_ad9371_xcvr/up_es_1]
connect_bd_intf_net [get_bd_intf_pins axi_ad9371_rx_xcvr/up_ch_1] [get_bd_intf_pins util_ad9371_xcvr/up_rx_1]
connect_bd_intf_net [get_bd_intf_pins util_ad9371_xcvr/rx_1] [get_bd_intf_pins axi_ad9371_rx_jesd/rx_phy1]
connect_bd_intf_net [get_bd_intf_pins axi_ad9371_rx_os_xcvr/up_es_0] [get_bd_intf_pins util_ad9371_xcvr/up_es_2]
connect_bd_intf_net [get_bd_intf_pins axi_ad9371_rx_os_xcvr/up_ch_0] [get_bd_intf_pins util_ad9371_xcvr/up_rx_2]
connect_bd_intf_net [get_bd_intf_pins util_ad9371_xcvr/rx_2] [get_bd_intf_pins axi_ad9371_rx_os_jesd/rx_phy0]
connect_bd_intf_net [get_bd_intf_pins axi_ad9371_rx_os_xcvr/up_es_1] [get_bd_intf_pins util_ad9371_xcvr/up_es_3]
connect_bd_intf_net [get_bd_intf_pins axi_ad9371_rx_os_xcvr/up_ch_1] [get_bd_intf_pins util_ad9371_xcvr/up_rx_3]
connect_bd_intf_net [get_bd_intf_pins util_ad9371_xcvr/rx_3] [get_bd_intf_pins axi_ad9371_rx_os_jesd/rx_phy1]
connect_bd_intf_net [get_bd_intf_pins axi_cpu_interconnect/M09_AXI] [get_bd_intf_pins axi_ad9371_core/s_axi]
connect_bd_intf_net [get_bd_intf_pins axi_cpu_interconnect/M10_AXI] [get_bd_intf_pins axi_ad9371_tx_xcvr/s_axi]
connect_bd_intf_net [get_bd_intf_pins axi_cpu_interconnect/M11_AXI] [get_bd_intf_pins axi_ad9371_tx_clkgen/s_axi]
connect_bd_intf_net [get_bd_intf_pins axi_cpu_interconnect/M12_AXI] [get_bd_intf_pins axi_ad9371_tx_jesd/s_axi]
connect_bd_intf_net [get_bd_intf_pins axi_cpu_interconnect/M13_AXI] [get_bd_intf_pins axi_ad9371_tx_dma/s_axi]
connect_bd_intf_net [get_bd_intf_pins axi_cpu_interconnect/M14_AXI] [get_bd_intf_pins axi_ad9371_rx_xcvr/s_axi]
connect_bd_intf_net [get_bd_intf_pins axi_cpu_interconnect/M15_AXI] [get_bd_intf_pins axi_ad9371_rx_clkgen/s_axi]
connect_bd_intf_net [get_bd_intf_pins axi_cpu_interconnect/M16_AXI] [get_bd_intf_pins axi_ad9371_rx_jesd/s_axi]
connect_bd_intf_net [get_bd_intf_pins axi_cpu_interconnect/M17_AXI] [get_bd_intf_pins axi_ad9371_rx_dma/s_axi]
connect_bd_intf_net [get_bd_intf_pins axi_cpu_interconnect/M18_AXI] [get_bd_intf_pins axi_ad9371_rx_os_xcvr/s_axi]
connect_bd_intf_net [get_bd_intf_pins axi_cpu_interconnect/M19_AXI] [get_bd_intf_pins axi_ad9371_rx_os_clkgen/s_axi]
connect_bd_intf_net [get_bd_intf_pins axi_cpu_interconnect/M20_AXI] [get_bd_intf_pins axi_ad9371_rx_os_jesd/s_axi]
connect_bd_intf_net [get_bd_intf_pins axi_cpu_interconnect/M21_AXI] [get_bd_intf_pins axi_ad9371_rx_os_dma/s_axi]
connect_bd_intf_net [get_bd_intf_pins axi_mem_interconnect/S05_AXI] [get_bd_intf_pins axi_ad9371_rx_xcvr/m_axi]
connect_bd_intf_net [get_bd_intf_pins axi_mem_interconnect/S06_AXI] [get_bd_intf_pins axi_ad9371_rx_os_xcvr/m_axi]
connect_bd_intf_net [get_bd_intf_pins axi_mem_interconnect/S07_AXI] [get_bd_intf_pins axi_ad9371_tx_dma/m_src_axi]
connect_bd_intf_net [get_bd_intf_pins axi_mem_interconnect/S08_AXI] [get_bd_intf_pins axi_ad9371_rx_dma/m_dest_axi]
connect_bd_intf_net [get_bd_intf_pins axi_mem_interconnect/S09_AXI] [get_bd_intf_pins axi_ad9371_rx_os_dma/m_dest_axi]
connect_bd_intf_net [get_bd_intf_pins sys_dlmb_cntlr/BRAM_PORT] [get_bd_intf_pins blk_mem_gen_0/BRAM_PORTA]
connect_bd_intf_net [get_bd_intf_pins sys_ilmb_cntlr/BRAM_PORT] [get_bd_intf_pins blk_mem_gen_0/BRAM_PORTB]
connect_bd_intf_net [get_bd_intf_pins axi_mem_interconnect/M00_AXI] [get_bd_intf_pins mig_7series_0/S_AXI]
connect_bd_intf_net [get_bd_intf_ports mdio] [get_bd_intf_pins axi_ethernet/mdio]
connect_bd_intf_net [get_bd_intf_ports sgmii] [get_bd_intf_pins axi_ethernet/sgmii]
connect_bd_intf_net [get_bd_intf_ports phy_clk] [get_bd_intf_pins axi_ethernet/lvds_clk]
connect_bd_intf_net [get_bd_intf_ports iic_main] [get_bd_intf_pins axi_iic_main/IIC]
connect_bd_intf_net [get_bd_intf_ports DDR3] [get_bd_intf_pins mig_7series_0/DDR3]
connect_bd_net -net axi_ddr_cntrl_c0_ddr4_ui_clk_sync_rst [get_bd_pins mig_7series_0/ui_clk_sync_rst] \
  [get_bd_pins axi_ddr_cntrl_rstgen/ext_reset_in] [get_bd_pins sys_rstgen/ext_reset_in]
connect_bd_net -net sys_mem_clk [get_bd_pins mig_7series_0/ui_clk] \
  [get_bd_pins axi_ddr_cntrl_rstgen/slowest_sync_clk] [get_bd_pins axi_mem_interconnect/M00_ACLK]
connect_bd_net -net sys_cpu_clk [get_bd_pins mig_7series_0/ui_addn_clk_0] \
  [get_bd_pins axi_ad9371_core/s_axi_aclk] [get_bd_pins axi_ad9371_rx_clkgen/s_axi_aclk] \
  [get_bd_pins axi_ad9371_rx_dma/s_axi_aclk] [get_bd_pins axi_ad9371_rx_os_clkgen/s_axi_aclk] \
  [get_bd_pins axi_ad9371_rx_os_dma/s_axi_aclk] [get_bd_pins axi_ad9371_rx_os_xcvr/s_axi_aclk] \
  [get_bd_pins axi_ad9371_rx_xcvr/s_axi_aclk] [get_bd_pins axi_ad9371_tx_clkgen/s_axi_aclk] \
  [get_bd_pins axi_ad9371_tx_dma/s_axi_aclk] [get_bd_pins axi_ad9371_tx_xcvr/s_axi_aclk] \
  [get_bd_pins axi_ethernet/s_axi_lite_clk] [get_bd_pins axi_ethernet/axis_clk] \
  [get_bd_pins axi_ethernet_dma/s_axi_lite_aclk] [get_bd_pins axi_ethernet_dma/m_axi_sg_aclk] \
  [get_bd_pins axi_ethernet_dma/m_axi_mm2s_aclk] [get_bd_pins axi_ethernet_dma/m_axi_s2mm_aclk] \
  [get_bd_pins axi_gpio/s_axi_aclk] [get_bd_pins axi_iic_main/s_axi_aclk] [get_bd_pins axi_intc/s_axi_aclk] \
  [get_bd_pins axi_spi/ext_spi_clk] [get_bd_pins axi_spi/s_axi_aclk] [get_bd_pins axi_timer/s_axi_aclk] \
  [get_bd_pins axi_uart/s_axi_aclk] [get_bd_pins sys_dlmb/LMB_Clk] [get_bd_pins sys_dlmb_cntlr/LMB_Clk] \
  [get_bd_pins sys_ilmb/LMB_Clk] [get_bd_pins sys_ilmb_cntlr/LMB_Clk] [get_bd_pins sys_mb/Clk] \
  [get_bd_pins sys_mb_debug/S_AXI_ACLK] [get_bd_pins sys_rstgen/slowest_sync_clk] [get_bd_pins util_ad9371_xcvr/up_clk] \
  [get_bd_pins axi_ad9371_tx_jesd/s_axi_aclk] [get_bd_pins axi_ad9371_rx_jesd/s_axi_aclk] \
  [get_bd_pins axi_ad9371_rx_os_jesd/s_axi_aclk] [get_bd_pins axi_cpu_interconnect/ACLK] \
  [get_bd_pins axi_cpu_interconnect/S00_ACLK] [get_bd_pins axi_cpu_interconnect/M00_ACLK] \
  [get_bd_pins axi_cpu_interconnect/M01_ACLK] [get_bd_pins axi_cpu_interconnect/M02_ACLK] \
  [get_bd_pins axi_cpu_interconnect/M03_ACLK] [get_bd_pins axi_cpu_interconnect/M04_ACLK] \
  [get_bd_pins axi_cpu_interconnect/M05_ACLK] [get_bd_pins axi_cpu_interconnect/M06_ACLK] \
  [get_bd_pins axi_cpu_interconnect/M07_ACLK] [get_bd_pins axi_cpu_interconnect/M08_ACLK] \
  [get_bd_pins axi_cpu_interconnect/M09_ACLK] [get_bd_pins axi_cpu_interconnect/M10_ACLK] \
  [get_bd_pins axi_cpu_interconnect/M11_ACLK] [get_bd_pins axi_cpu_interconnect/M12_ACLK] \
  [get_bd_pins axi_cpu_interconnect/M13_ACLK] [get_bd_pins axi_cpu_interconnect/M14_ACLK] \
  [get_bd_pins axi_cpu_interconnect/M15_ACLK] [get_bd_pins axi_cpu_interconnect/M16_ACLK] \
  [get_bd_pins axi_cpu_interconnect/M17_ACLK] [get_bd_pins axi_cpu_interconnect/M18_ACLK] \
  [get_bd_pins axi_cpu_interconnect/M19_ACLK] [get_bd_pins axi_cpu_interconnect/M20_ACLK] \
  [get_bd_pins axi_cpu_interconnect/M21_ACLK] [get_bd_pins axi_mem_interconnect/ACLK] \
  [get_bd_pins axi_mem_interconnect/S00_ACLK] [get_bd_pins axi_mem_interconnect/S01_ACLK] \
  [get_bd_pins axi_mem_interconnect/S02_ACLK] [get_bd_pins axi_mem_interconnect/S03_ACLK] \
  [get_bd_pins axi_mem_interconnect/S04_ACLK] [get_bd_pins axi_mem_interconnect/S05_ACLK] \
  [get_bd_pins axi_mem_interconnect/S06_ACLK]
connect_bd_net -net sys_cpu_reset [get_bd_pins sys_rstgen/peripheral_reset] [get_bd_pins sys_dma_rstgen/ext_reset_in]
connect_bd_net -net sys_cpu_resetn [get_bd_pins sys_rstgen/peripheral_aresetn] \
  [get_bd_pins axi_ad9371_core/s_axi_aresetn] [get_bd_pins axi_ad9371_rx_clkgen/s_axi_aresetn] \
  [get_bd_pins axi_ad9371_rx_dma/s_axi_aresetn] [get_bd_pins axi_ad9371_rx_jesd_rstgen/ext_reset_in] \
  [get_bd_pins axi_ad9371_rx_os_clkgen/s_axi_aresetn] [get_bd_pins axi_ad9371_rx_os_dma/s_axi_aresetn] \
  [get_bd_pins axi_ad9371_rx_os_jesd_rstgen/ext_reset_in] [get_bd_pins axi_ad9371_rx_os_xcvr/s_axi_aresetn] \
  [get_bd_pins axi_ad9371_rx_xcvr/s_axi_aresetn] [get_bd_pins axi_ad9371_tx_clkgen/s_axi_aresetn] \
  [get_bd_pins axi_ad9371_tx_dma/s_axi_aresetn] [get_bd_pins axi_ad9371_tx_jesd_rstgen/ext_reset_in] \
  [get_bd_pins axi_ad9371_tx_xcvr/s_axi_aresetn] [get_bd_pins axi_ethernet/s_axi_lite_resetn] \
  [get_bd_pins axi_ethernet_dma/axi_resetn] [get_bd_pins axi_gpio/s_axi_aresetn] [get_bd_pins axi_iic_main/s_axi_aresetn] \
  [get_bd_pins axi_intc/s_axi_aresetn] [get_bd_pins axi_spi/s_axi_aresetn] [get_bd_pins axi_timer/s_axi_aresetn] \
  [get_bd_pins axi_uart/s_axi_aresetn] [get_bd_pins sys_mb_debug/S_AXI_ARESETN] [get_bd_pins util_ad9371_xcvr/up_rstn] \
  [get_bd_pins axi_ad9371_tx_jesd/s_axi_aresetn] [get_bd_pins axi_ad9371_rx_jesd/s_axi_aresetn] \
  [get_bd_pins axi_ad9371_rx_os_jesd/s_axi_aresetn] [get_bd_pins axi_cpu_interconnect/ARESETN] \
  [get_bd_pins axi_cpu_interconnect/S00_ARESETN] [get_bd_pins axi_cpu_interconnect/M00_ARESETN] \
  [get_bd_pins axi_cpu_interconnect/M01_ARESETN] [get_bd_pins axi_cpu_interconnect/M02_ARESETN] \
  [get_bd_pins axi_cpu_interconnect/M03_ARESETN] [get_bd_pins axi_cpu_interconnect/M04_ARESETN] \
  [get_bd_pins axi_cpu_interconnect/M05_ARESETN] [get_bd_pins axi_cpu_interconnect/M06_ARESETN] \
  [get_bd_pins axi_cpu_interconnect/M07_ARESETN] [get_bd_pins axi_cpu_interconnect/M08_ARESETN] \
  [get_bd_pins axi_cpu_interconnect/M09_ARESETN] [get_bd_pins axi_cpu_interconnect/M10_ARESETN] \
  [get_bd_pins axi_cpu_interconnect/M11_ARESETN] [get_bd_pins axi_cpu_interconnect/M12_ARESETN] \
  [get_bd_pins axi_cpu_interconnect/M13_ARESETN] [get_bd_pins axi_cpu_interconnect/M14_ARESETN] \
  [get_bd_pins axi_cpu_interconnect/M15_ARESETN] [get_bd_pins axi_cpu_interconnect/M16_ARESETN] \
  [get_bd_pins axi_cpu_interconnect/M17_ARESETN] [get_bd_pins axi_cpu_interconnect/M18_ARESETN] \
  [get_bd_pins axi_cpu_interconnect/M19_ARESETN] [get_bd_pins axi_cpu_interconnect/M20_ARESETN] \
  [get_bd_pins axi_cpu_interconnect/M21_ARESETN] [get_bd_pins axi_mem_interconnect/ARESETN] \
  [get_bd_pins axi_mem_interconnect/S00_ARESETN] [get_bd_pins axi_mem_interconnect/S01_ARESETN] \
  [get_bd_pins axi_mem_interconnect/S02_ARESETN] [get_bd_pins axi_mem_interconnect/S03_ARESETN] \
  [get_bd_pins axi_mem_interconnect/S04_ARESETN] [get_bd_pins axi_mem_interconnect/S05_ARESETN] \
  [get_bd_pins axi_mem_interconnect/S06_ARESETN]
connect_bd_net [get_bd_pins sys_rstgen/mb_reset] [get_bd_pins sys_mb/Reset]
connect_bd_net [get_bd_pins sys_rstgen/bus_struct_reset] \
  [get_bd_pins sys_dlmb/SYS_Rst] [get_bd_pins sys_dlmb_cntlr/LMB_Rst] [get_bd_pins sys_ilmb/SYS_Rst] \
  [get_bd_pins sys_ilmb_cntlr/LMB_Rst]
connect_bd_net [get_bd_pins sys_mb_debug/Debug_SYS_Rst] [get_bd_pins sys_rstgen/mb_debug_sys_rst]
connect_bd_net [get_bd_pins sys_concat_intc/dout] [get_bd_pins axi_intc/intr]
connect_bd_net [get_bd_ports phy_sd] [get_bd_pins axi_ethernet/signal_detect]
connect_bd_net [get_bd_pins axi_ethernet/phy_rst_n] [get_bd_ports phy_rst_n]
connect_bd_net [get_bd_pins axi_ethernet_dma/mm2s_prmry_reset_out_n] [get_bd_pins axi_ethernet/axi_txd_arstn]
connect_bd_net [get_bd_pins axi_ethernet_dma/mm2s_cntrl_reset_out_n] [get_bd_pins axi_ethernet/axi_txc_arstn]
connect_bd_net [get_bd_pins axi_ethernet_dma/s2mm_prmry_reset_out_n] [get_bd_pins axi_ethernet/axi_rxd_arstn]
connect_bd_net [get_bd_pins axi_ethernet_dma/s2mm_sts_reset_out_n] [get_bd_pins axi_ethernet/axi_rxs_arstn]
connect_bd_net [get_bd_ports uart_sin] [get_bd_pins axi_uart/rx]
connect_bd_net [get_bd_pins axi_uart/tx] [get_bd_ports uart_sout]
connect_bd_net [get_bd_ports spi_csn_i] [get_bd_pins axi_spi/ss_i]
connect_bd_net [get_bd_pins axi_spi/ss_o] [get_bd_ports spi_csn_o]
connect_bd_net [get_bd_ports spi_clk_i] [get_bd_pins axi_spi/sck_i]
connect_bd_net [get_bd_pins axi_spi/sck_o] [get_bd_ports spi_clk_o]
connect_bd_net [get_bd_ports spi_sdo_i] [get_bd_pins axi_spi/io0_i]
connect_bd_net [get_bd_pins axi_spi/io0_o] [get_bd_ports spi_sdo_o]
connect_bd_net [get_bd_ports spi_sdi_i] [get_bd_pins axi_spi/io1_i]
connect_bd_net [get_bd_ports gpio0_i] [get_bd_pins axi_gpio/gpio_io_i]
connect_bd_net [get_bd_pins axi_gpio/gpio_io_o] [get_bd_ports gpio0_o]
connect_bd_net [get_bd_pins axi_gpio/gpio_io_t] [get_bd_ports gpio0_t]
connect_bd_net [get_bd_ports gpio1_i] [get_bd_pins axi_gpio/gpio2_io_i]
connect_bd_net [get_bd_pins axi_gpio/gpio2_io_o] [get_bd_ports gpio1_o]
connect_bd_net [get_bd_pins axi_gpio/gpio2_io_t] [get_bd_ports gpio1_t]
connect_bd_net [get_bd_pins axi_timer/interrupt] [get_bd_pins sys_concat_intc/In0]
connect_bd_net [get_bd_pins axi_ethernet/interrupt] [get_bd_pins sys_concat_intc/In1]
connect_bd_net [get_bd_pins axi_ethernet_dma/mm2s_introut] [get_bd_pins sys_concat_intc/In2]
connect_bd_net [get_bd_pins axi_ethernet_dma/s2mm_introut] [get_bd_pins sys_concat_intc/In3]
connect_bd_net [get_bd_pins axi_uart/interrupt] [get_bd_pins sys_concat_intc/In4]
connect_bd_net -net mb_intr_05_1 [get_bd_ports mb_intr_05] [get_bd_pins sys_concat_intc/In5]
connect_bd_net -net mb_intr_06_1 [get_bd_ports mb_intr_06] [get_bd_pins sys_concat_intc/In6]
connect_bd_net [get_bd_pins axi_iic_main/iic2intc_irpt] [get_bd_pins sys_concat_intc/In9]
connect_bd_net [get_bd_pins axi_spi/ip2intc_irpt] [get_bd_pins sys_concat_intc/In10]
connect_bd_net [get_bd_pins axi_gpio/ip2intc_irpt] [get_bd_pins sys_concat_intc/In11]
connect_bd_net -net tx_ref_clk_0_1 [get_bd_ports tx_ref_clk_0] [get_bd_pins util_ad9371_xcvr/qpll_ref_clk_0]
connect_bd_net -net rx_ref_clk_0_1 [get_bd_ports rx_ref_clk_0] \
  [get_bd_pins util_ad9371_xcvr/cpll_ref_clk_0] [get_bd_pins util_ad9371_xcvr/cpll_ref_clk_1]
connect_bd_net -net rx_ref_clk_2_1 [get_bd_ports rx_ref_clk_2] \
  [get_bd_pins util_ad9371_xcvr/cpll_ref_clk_2] [get_bd_pins util_ad9371_xcvr/cpll_ref_clk_3]
connect_bd_net [get_bd_pins axi_ad9371_tx_xcvr/up_pll_rst] [get_bd_pins util_ad9371_xcvr/up_qpll_rst_0]
connect_bd_net [get_bd_pins axi_ad9371_rx_xcvr/up_pll_rst] [get_bd_pins util_ad9371_xcvr/up_cpll_rst_0] [get_bd_pins util_ad9371_xcvr/up_cpll_rst_1]
connect_bd_net [get_bd_pins axi_ad9371_rx_os_xcvr/up_pll_rst] \
  [get_bd_pins util_ad9371_xcvr/up_cpll_rst_2] [get_bd_pins util_ad9371_xcvr/up_cpll_rst_3]
connect_bd_net [get_bd_pins util_ad9371_xcvr/tx_0_p] [get_bd_ports tx_data_0_p]
connect_bd_net [get_bd_pins util_ad9371_xcvr/tx_0_n] [get_bd_ports tx_data_0_n]
connect_bd_net [get_bd_pins util_ad9371_xcvr/tx_1_p] [get_bd_ports tx_data_1_p]
connect_bd_net [get_bd_pins util_ad9371_xcvr/tx_1_n] [get_bd_ports tx_data_1_n]
connect_bd_net [get_bd_pins util_ad9371_xcvr/tx_2_p] [get_bd_ports tx_data_2_p]
connect_bd_net [get_bd_pins util_ad9371_xcvr/tx_2_n] [get_bd_ports tx_data_2_n]
connect_bd_net [get_bd_pins util_ad9371_xcvr/tx_3_p] [get_bd_ports tx_data_3_p]
connect_bd_net [get_bd_pins util_ad9371_xcvr/tx_3_n] [get_bd_ports tx_data_3_n]
connect_bd_net -net sysref_1 [get_bd_ports tx_sysref_0] [get_bd_pins axi_ad9371_tx_jesd/sysref]
connect_bd_net -net sync_1 [get_bd_ports tx_sync_0] [get_bd_pins axi_ad9371_tx_jesd/sync]
connect_bd_net [get_bd_pins util_ad9371_xcvr/tx_out_clk_0] [get_bd_pins axi_ad9371_tx_clkgen/clk]
connect_bd_net [get_bd_pins axi_ad9371_tx_clkgen/clk_0] \
  [get_bd_pins axi_ad9371_core/dac_clk] [get_bd_pins axi_ad9371_dacfifo/dac_clk] \
  [get_bd_pins axi_ad9371_tx_jesd_rstgen/slowest_sync_clk] [get_bd_pins util_ad9371_tx_upack/dac_clk] \
  [get_bd_pins util_ad9371_xcvr/tx_clk_0] [get_bd_pins util_ad9371_xcvr/tx_clk_1] [get_bd_pins util_ad9371_xcvr/tx_clk_2] \
  [get_bd_pins util_ad9371_xcvr/tx_clk_3] [get_bd_pins axi_ad9371_tx_jesd/device_clk]
connect_bd_net [get_bd_pins axi_ad9371_rx_jesd/phy_en_char_align] \
  [get_bd_pins util_ad9371_xcvr/rx_calign_0] [get_bd_pins util_ad9371_xcvr/rx_calign_1]
connect_bd_net [get_bd_ports rx_data_0_p] [get_bd_pins util_ad9371_xcvr/rx_0_p]
connect_bd_net [get_bd_ports rx_data_0_n] [get_bd_pins util_ad9371_xcvr/rx_0_n]
connect_bd_net [get_bd_ports rx_data_1_p] [get_bd_pins util_ad9371_xcvr/rx_1_p]
connect_bd_net [get_bd_ports rx_data_1_n] [get_bd_pins util_ad9371_xcvr/rx_1_n]
connect_bd_net -net sysref_2 [get_bd_ports rx_sysref_0] [get_bd_pins axi_ad9371_rx_jesd/sysref]
connect_bd_net [get_bd_pins axi_ad9371_rx_jesd/sync] [get_bd_ports rx_sync_0]
connect_bd_net [get_bd_pins util_ad9371_xcvr/rx_out_clk_0] [get_bd_pins axi_ad9371_rx_clkgen/clk]
connect_bd_net [get_bd_pins axi_ad9371_rx_clkgen/clk_0] \
  [get_bd_pins axi_ad9371_core/adc_clk] [get_bd_pins axi_ad9371_rx_dma/fifo_wr_clk] \
  [get_bd_pins axi_ad9371_rx_jesd_rstgen/slowest_sync_clk] [get_bd_pins util_ad9371_rx_cpack/adc_clk] \
  [get_bd_pins util_ad9371_xcvr/rx_clk_0] [get_bd_pins util_ad9371_xcvr/rx_clk_1] [get_bd_pins axi_ad9371_rx_jesd/device_clk]
connect_bd_net [get_bd_pins axi_ad9371_rx_os_jesd/phy_en_char_align] \
  [get_bd_pins util_ad9371_xcvr/rx_calign_2] [get_bd_pins util_ad9371_xcvr/rx_calign_3]
connect_bd_net [get_bd_ports rx_data_2_p] [get_bd_pins util_ad9371_xcvr/rx_2_p]
connect_bd_net [get_bd_ports rx_data_2_n] [get_bd_pins util_ad9371_xcvr/rx_2_n]
connect_bd_net [get_bd_ports rx_data_3_p] [get_bd_pins util_ad9371_xcvr/rx_3_p]
connect_bd_net [get_bd_ports rx_data_3_n] [get_bd_pins util_ad9371_xcvr/rx_3_n]
connect_bd_net -net sysref_3 [get_bd_ports rx_sysref_2] [get_bd_pins axi_ad9371_rx_os_jesd/sysref]
connect_bd_net [get_bd_pins axi_ad9371_rx_os_jesd/sync] [get_bd_ports rx_sync_2]
connect_bd_net [get_bd_pins util_ad9371_xcvr/rx_out_clk_2] [get_bd_pins axi_ad9371_rx_os_clkgen/clk]
connect_bd_net [get_bd_pins axi_ad9371_rx_os_clkgen/clk_0] \
  [get_bd_pins axi_ad9371_core/adc_os_clk] [get_bd_pins axi_ad9371_rx_os_dma/fifo_wr_clk] \
  [get_bd_pins axi_ad9371_rx_os_jesd_rstgen/slowest_sync_clk] [get_bd_pins util_ad9371_rx_os_cpack/adc_clk] \
  [get_bd_pins util_ad9371_xcvr/rx_clk_2] [get_bd_pins util_ad9371_xcvr/rx_clk_3] \
  [get_bd_pins axi_ad9371_rx_os_jesd/device_clk]
connect_bd_net -net sys_dma_clk [get_bd_pins mig_7series_0/ui_addn_clk_1] \
  [get_bd_pins axi_ad9371_dacfifo/dma_clk] [get_bd_pins axi_ad9371_rx_dma/m_dest_axi_aclk] \
  [get_bd_pins axi_ad9371_rx_os_dma/m_dest_axi_aclk] [get_bd_pins axi_ad9371_tx_dma/m_src_axi_aclk] \
  [get_bd_pins axi_ad9371_tx_dma/m_axis_aclk] [get_bd_pins sys_dma_rstgen/slowest_sync_clk] \
  [get_bd_pins axi_mem_interconnect/S07_ACLK] [get_bd_pins axi_mem_interconnect/S08_ACLK] \
  [get_bd_pins axi_mem_interconnect/S09_ACLK]
connect_bd_net -net sys_dma_resetn [get_bd_pins sys_dma_rstgen/peripheral_aresetn] \
  [get_bd_pins axi_ad9371_rx_dma/m_dest_axi_aresetn] [get_bd_pins axi_ad9371_rx_os_dma/m_dest_axi_aresetn] \
  [get_bd_pins axi_ad9371_tx_dma/m_src_axi_aresetn] [get_bd_pins axi_mem_interconnect/S07_ARESETN] \
  [get_bd_pins axi_mem_interconnect/S08_ARESETN] [get_bd_pins axi_mem_interconnect/S09_ARESETN]
connect_bd_net -net sys_dma_reset [get_bd_pins sys_dma_rstgen/peripheral_reset] [get_bd_pins axi_ad9371_dacfifo/dma_rst]
connect_bd_net -net tx_data_tdata_1 [get_bd_pins axi_ad9371_core/dac_tx_data] [get_bd_pins axi_ad9371_tx_jesd/tx_data_tdata]
connect_bd_net [get_bd_pins axi_ad9371_core/dac_valid_i0] [get_bd_pins util_ad9371_tx_upack/dac_valid_0]
connect_bd_net [get_bd_pins axi_ad9371_core/dac_enable_i0] [get_bd_pins util_ad9371_tx_upack/dac_enable_0]
connect_bd_net [get_bd_pins util_ad9371_tx_upack/dac_data_0] [get_bd_pins axi_ad9371_core/dac_data_i0]
connect_bd_net [get_bd_pins axi_ad9371_core/dac_valid_q0] [get_bd_pins util_ad9371_tx_upack/dac_valid_1]
connect_bd_net [get_bd_pins axi_ad9371_core/dac_enable_q0] [get_bd_pins util_ad9371_tx_upack/dac_enable_1]
connect_bd_net [get_bd_pins util_ad9371_tx_upack/dac_data_1] [get_bd_pins axi_ad9371_core/dac_data_q0]
connect_bd_net [get_bd_pins axi_ad9371_core/dac_valid_i1] [get_bd_pins util_ad9371_tx_upack/dac_valid_2]
connect_bd_net [get_bd_pins axi_ad9371_core/dac_enable_i1] [get_bd_pins util_ad9371_tx_upack/dac_enable_2]
connect_bd_net [get_bd_pins util_ad9371_tx_upack/dac_data_2] [get_bd_pins axi_ad9371_core/dac_data_i1]
connect_bd_net [get_bd_pins axi_ad9371_core/dac_valid_q1] [get_bd_pins util_ad9371_tx_upack/dac_valid_3]
connect_bd_net [get_bd_pins axi_ad9371_core/dac_enable_q1] [get_bd_pins util_ad9371_tx_upack/dac_enable_3]
connect_bd_net [get_bd_pins util_ad9371_tx_upack/dac_data_3] [get_bd_pins axi_ad9371_core/dac_data_q1]
connect_bd_net [get_bd_pins axi_ad9371_tx_jesd_rstgen/peripheral_reset] [get_bd_pins axi_ad9371_dacfifo/dac_rst]
connect_bd_net [get_bd_pins util_ad9371_tx_upack/dac_valid] [get_bd_pins axi_ad9371_dacfifo/dac_valid]
connect_bd_net [get_bd_pins axi_ad9371_dacfifo/dac_data] [get_bd_pins util_ad9371_tx_upack/dac_data]
connect_bd_net [get_bd_pins axi_ad9371_tx_dma/m_axis_valid] [get_bd_pins axi_ad9371_dacfifo/dma_valid]
connect_bd_net [get_bd_pins axi_ad9371_tx_dma/m_axis_data] [get_bd_pins axi_ad9371_dacfifo/dma_data]
connect_bd_net [get_bd_pins axi_ad9371_dacfifo/dma_ready] [get_bd_pins axi_ad9371_tx_dma/m_axis_ready]
connect_bd_net [get_bd_pins axi_ad9371_tx_dma/m_axis_xfer_req] [get_bd_pins axi_ad9371_dacfifo/dma_xfer_req]
connect_bd_net [get_bd_pins axi_ad9371_tx_dma/m_axis_last] [get_bd_pins axi_ad9371_dacfifo/dma_xfer_last]
connect_bd_net [get_bd_pins axi_ad9371_dacfifo/dac_dunf] [get_bd_pins axi_ad9371_core/dac_dunf]
connect_bd_net [get_bd_ports dac_fifo_bypass] [get_bd_pins axi_ad9371_dacfifo/bypass]
connect_bd_net [get_bd_pins axi_ad9371_rx_jesd/rx_sof] [get_bd_pins axi_ad9371_core/adc_rx_sof]
connect_bd_net [get_bd_pins axi_ad9371_rx_jesd/rx_data_tdata] [get_bd_pins axi_ad9371_core/adc_rx_data]
connect_bd_net [get_bd_pins axi_ad9371_rx_jesd_rstgen/peripheral_reset] [get_bd_pins util_ad9371_rx_cpack/adc_rst]
connect_bd_net [get_bd_pins axi_ad9371_core/adc_enable_i0] [get_bd_pins util_ad9371_rx_cpack/adc_enable_0]
connect_bd_net [get_bd_pins axi_ad9371_core/adc_valid_i0] [get_bd_pins util_ad9371_rx_cpack/adc_valid_0]
connect_bd_net [get_bd_pins axi_ad9371_core/adc_data_i0] [get_bd_pins util_ad9371_rx_cpack/adc_data_0]
connect_bd_net [get_bd_pins axi_ad9371_core/adc_enable_q0] [get_bd_pins util_ad9371_rx_cpack/adc_enable_1]
connect_bd_net [get_bd_pins axi_ad9371_core/adc_valid_q0] [get_bd_pins util_ad9371_rx_cpack/adc_valid_1]
connect_bd_net [get_bd_pins axi_ad9371_core/adc_data_q0] [get_bd_pins util_ad9371_rx_cpack/adc_data_1]
connect_bd_net [get_bd_pins axi_ad9371_core/adc_enable_i1] [get_bd_pins util_ad9371_rx_cpack/adc_enable_2]
connect_bd_net [get_bd_pins axi_ad9371_core/adc_valid_i1] [get_bd_pins util_ad9371_rx_cpack/adc_valid_2]
connect_bd_net [get_bd_pins axi_ad9371_core/adc_data_i1] [get_bd_pins util_ad9371_rx_cpack/adc_data_2]
connect_bd_net [get_bd_pins axi_ad9371_core/adc_enable_q1] [get_bd_pins util_ad9371_rx_cpack/adc_enable_3]
connect_bd_net [get_bd_pins axi_ad9371_core/adc_valid_q1] [get_bd_pins util_ad9371_rx_cpack/adc_valid_3]
connect_bd_net [get_bd_pins axi_ad9371_core/adc_data_q1] [get_bd_pins util_ad9371_rx_cpack/adc_data_3]
connect_bd_net [get_bd_pins util_ad9371_rx_cpack/adc_valid] [get_bd_pins axi_ad9371_rx_dma/fifo_wr_en]
connect_bd_net [get_bd_pins util_ad9371_rx_cpack/adc_sync] [get_bd_pins axi_ad9371_rx_dma/fifo_wr_sync]
connect_bd_net [get_bd_pins util_ad9371_rx_cpack/adc_data] [get_bd_pins axi_ad9371_rx_dma/fifo_wr_din]
connect_bd_net [get_bd_pins axi_ad9371_rx_dma/fifo_wr_overflow] [get_bd_pins axi_ad9371_core/adc_dovf]
connect_bd_net [get_bd_pins axi_ad9371_rx_os_jesd/rx_sof] [get_bd_pins axi_ad9371_core/adc_rx_os_sof]
connect_bd_net [get_bd_pins axi_ad9371_rx_os_jesd/rx_data_tdata] [get_bd_pins axi_ad9371_core/adc_rx_os_data]
connect_bd_net [get_bd_pins axi_ad9371_rx_os_jesd_rstgen/peripheral_reset] [get_bd_pins util_ad9371_rx_os_cpack/adc_rst]
connect_bd_net [get_bd_pins axi_ad9371_core/adc_os_enable_i0] [get_bd_pins util_ad9371_rx_os_cpack/adc_enable_0]
connect_bd_net [get_bd_pins axi_ad9371_core/adc_os_valid_i0] [get_bd_pins util_ad9371_rx_os_cpack/adc_valid_0]
connect_bd_net [get_bd_pins axi_ad9371_core/adc_os_data_i0] [get_bd_pins util_ad9371_rx_os_cpack/adc_data_0]
connect_bd_net [get_bd_pins axi_ad9371_core/adc_os_enable_q0] [get_bd_pins util_ad9371_rx_os_cpack/adc_enable_1]
connect_bd_net [get_bd_pins axi_ad9371_core/adc_os_valid_q0] [get_bd_pins util_ad9371_rx_os_cpack/adc_valid_1]
connect_bd_net [get_bd_pins axi_ad9371_core/adc_os_data_q0] [get_bd_pins util_ad9371_rx_os_cpack/adc_data_1]
connect_bd_net [get_bd_pins util_ad9371_rx_os_cpack/adc_valid] [get_bd_pins axi_ad9371_rx_os_dma/fifo_wr_en]
connect_bd_net [get_bd_pins util_ad9371_rx_os_cpack/adc_sync] [get_bd_pins axi_ad9371_rx_os_dma/fifo_wr_sync]
connect_bd_net [get_bd_pins util_ad9371_rx_os_cpack/adc_data] [get_bd_pins axi_ad9371_rx_os_dma/fifo_wr_din]
connect_bd_net [get_bd_pins axi_ad9371_rx_os_dma/fifo_wr_overflow] [get_bd_pins axi_ad9371_core/adc_os_dovf]
connect_bd_net [get_bd_pins axi_ad9371_rx_os_jesd/irq] [get_bd_pins sys_concat_intc/In8]
connect_bd_net [get_bd_pins axi_ad9371_tx_jesd/irq] [get_bd_pins sys_concat_intc/In7]
connect_bd_net [get_bd_pins axi_ad9371_rx_jesd/irq] [get_bd_pins sys_concat_intc/In15]
connect_bd_net [get_bd_pins axi_ad9371_rx_os_dma/irq] [get_bd_pins sys_concat_intc/In14]
connect_bd_net [get_bd_pins axi_ad9371_tx_dma/irq] [get_bd_pins sys_concat_intc/In13]
connect_bd_net [get_bd_pins axi_ad9371_rx_dma/irq] [get_bd_pins sys_concat_intc/In12]
connect_bd_net -net M00_ARESETN_1 [get_bd_pins axi_ddr_cntrl_rstgen/peripheral_aresetn] \
  [get_bd_pins mig_7series_0/aresetn] [get_bd_pins axi_mem_interconnect/M00_ARESETN]
connect_bd_net [get_bd_pins mig_7series_0/mmcm_locked] [get_bd_pins axi_ddr_cntrl_rstgen/dcm_locked]
connect_bd_net [get_bd_ports sys_rst] [get_bd_pins mig_7series_0/sys_rst]
